# Altium project obc_ver2.PrjPcb (part 2 of 3)

## Sheet obc-v2_EXP-CAN-RS422.SchDoc
size 420 x 297 mm; SheetNumber: 14; SheetTotal: 23
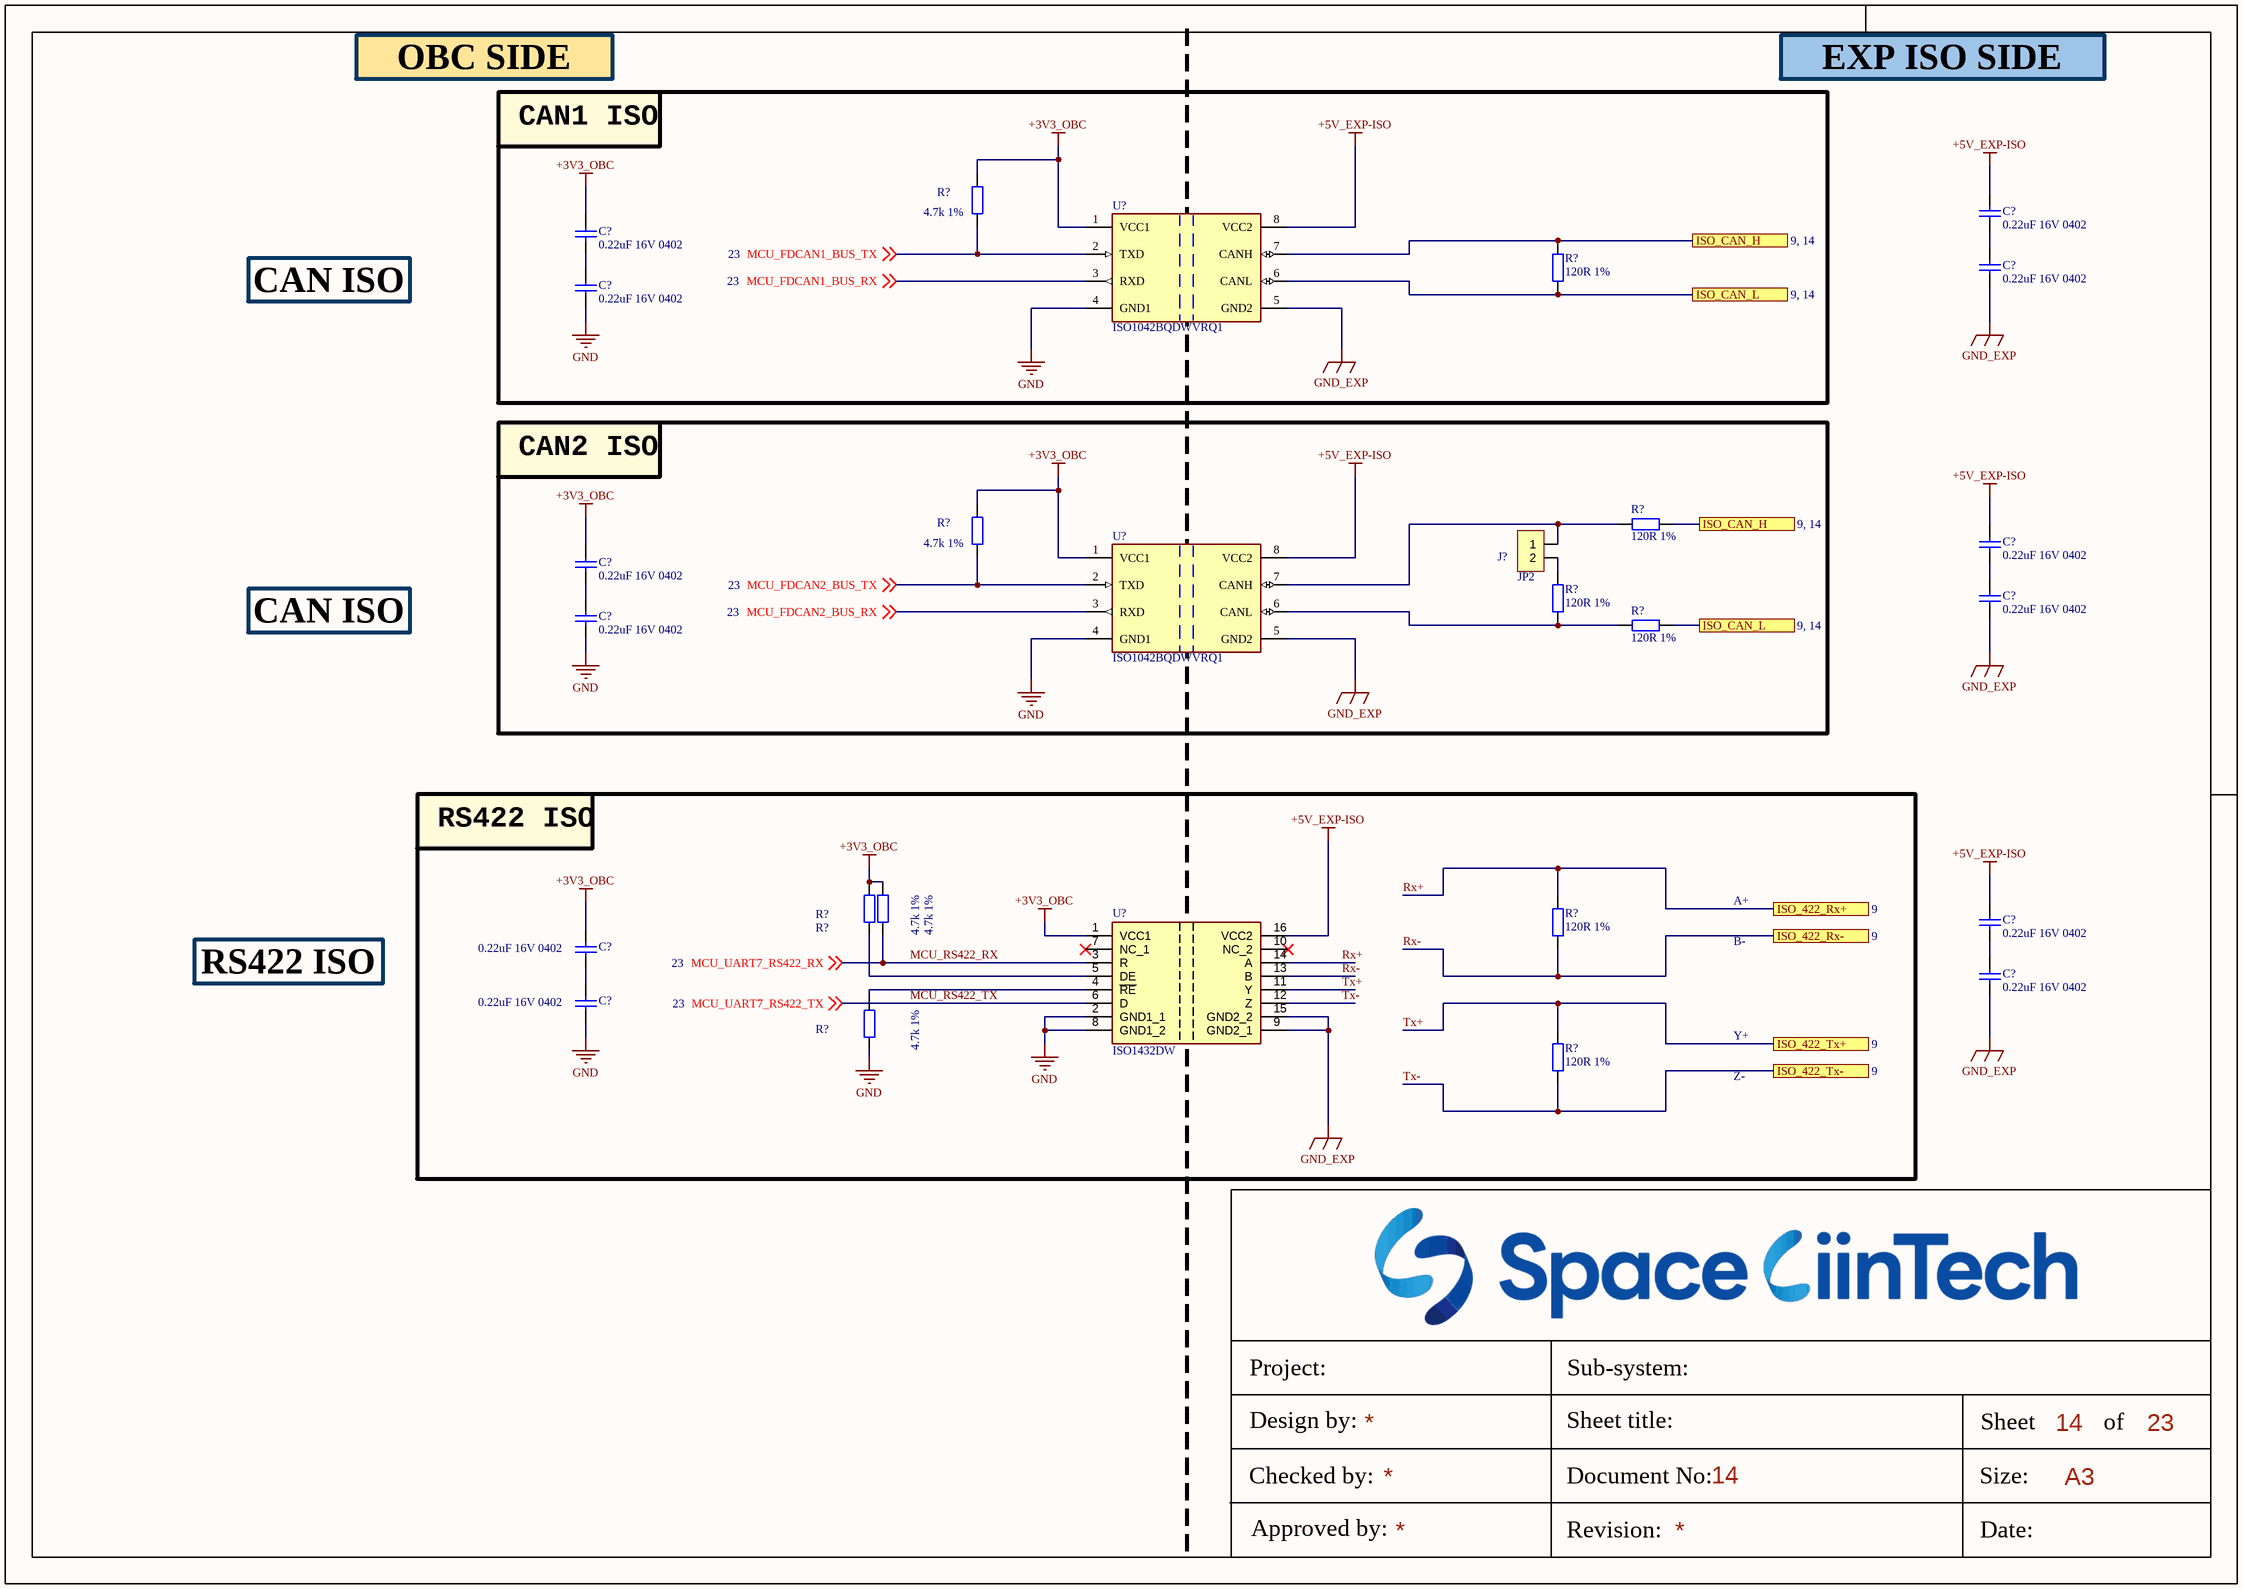
[diagram p13: obc-v2_EXP-CAN-RS422.SchDoc]

### Parts
(Parts that share a designator on the sheet are numbered #1, #2 ... from top to bottom, then left to right.)
C?#104  0.22uF 16V 0402  [tu 0402]
C?#105  0.22uF 16V 0402  [tu 0402]
C?#106  0.22uF 16V 0402  [tu 0402]
C?#107  0.22uF 16V 0402  [tu 0402]
C?#108  0.22uF 16V 0402  [tu 0402]
C?#109  0.22uF 16V 0402  [tu 0402]
C?#110  0.22uF 16V 0402  [tu 0402]
C?#111  0.22uF 16V 0402  [tu 0402]
C?#112  0.22uF 16V 0402  [tu 0402]
C?#113  0.22uF 16V 0402  [tu 0402]
C?#114  0.22uF 16V 0402  [tu 0402]
C?#115  0.22uF 16V 0402  [tu 0402]
J?#15  JP2  [JP2-D1T]
R?#47  4.7k 1%  [tro smd 0603]
R?#48  120R 1%  [tro smd 0603]
R?#49  120R 1%  [tro smd 0603]
R?#50  4.7k 1%  [tro smd 0603]
R?#51  120R 1%  [tro smd 0603]
R?#52  120R 1%  [tro smd 0603]
R?#53  4.7k 1%  [tro smd 0603]
R?#54  4.7k 1%  [tro smd 0603]
R?#55  120R 1%  [tro smd 0603]
R?#56  4.7k 1%  [tro smd 0603]
R?#57  120R 1%  [tro smd 0603]
U?#18  ISO1042BQDWVRQ1  [FP-DWV0008A-IPC_B]
U?#19  ISO1042BQDWVRQ1  [FP-DWV0008A-IPC_B]
U?#20  ISO1432DW  [SOIC127P1030X265-16N]

### Blocks framed on the sheet
CAN1 ISO: C?#105 C?#107 R?#47 R?#48 U?#18
CAN2 ISO: C?#109 C?#111 J?#15 R?#49-R?#52 U?#19
RS422 ISO: C?#113 C?#115 R?#53-R?#57 U?#20

### Ports
ISO_422_Rx+ (see 9), ISO_422_Rx- (see 9), ISO_422_Tx+ (see 9), ISO_422_Tx- (see 9), ISO_CAN_H (see 9, 14), ISO_CAN_L (see 9, 14)

### Nets
+3V3_OBC: C?#105.1 C?#109.1 C?#113.1 R?#47.2 R?#50.2 R?#53.2 R?#54.2 U?#18.1(VCC1) U?#19.1(VCC1) U?#20.1(VCC1)
+5V_EXP-ISO: C?#104.1 C?#108.1 C?#112.2 U?#18.8(VCC2) U?#19.8(VCC2) U?#20.16(VCC2)
GND: C?#107.2 C?#111.2 C?#115.2 R?#56.1 U?#18.4(GND1) U?#19.4(GND1) U?#20.2(GND1_1) U?#20.8(GND1_2)
GND_EXP: C?#106.2 C?#110.2 C?#114.1 U?#18.5(GND2) U?#19.5(GND2) U?#20.9(GND2_1) U?#20.15(GND2_2)
MCU_FDCAN1_BUS_RX: U?#18.3(RXD) ; off-sheet MCU_FDCAN1_BUS_RX
MCU_FDCAN1_BUS_TX: R?#47.1 U?#18.2(TXD) ; off-sheet MCU_FDCAN1_BUS_TX
MCU_FDCAN2_BUS_RX: U?#19.3(RXD) ; off-sheet MCU_FDCAN2_BUS_RX
MCU_FDCAN2_BUS_TX: R?#50.1 U?#19.2(TXD) ; off-sheet MCU_FDCAN2_BUS_TX
MCU_RS422_RX: R?#54.1 U?#20.3(R) ; off-sheet MCU_UART7_RS422_RX  [also labelled MCU_UART7_RS422_RX]
MCU_RS422_TX: U?#20.6(D) ; off-sheet MCU_UART7_RS422_TX  [also labelled MCU_UART7_RS422_TX]
Rx+: R?#55.2 U?#20.14(A) ; port ISO_422_Rx+
Rx-: R?#55.1 U?#20.13(B) ; port ISO_422_Rx-
Tx+: R?#57.2 U?#20.11(Y) ; port ISO_422_Tx+
Tx-: R?#57.1 U?#20.12(Z) ; port ISO_422_Tx-
NetC?#104_2: C?#104.2 C?#106.1
NetC?#105_2: C?#105.2 C?#107.1
NetC?#108_2: C?#108.2 C?#110.1
NetC?#109_2: C?#109.2 C?#111.1
NetC?#112_1: C?#112.1 C?#114.2
NetC?#113_2: C?#113.2 C?#115.1
NetJ?#3_4: R?#48.2 R?#49.1 U?#18.7(CANH) ; port ISO_CAN_H
NetJ?#3_25: R?#48.1 R?#52.1 U?#18.6(CANL) ; port ISO_CAN_L
NetJ?#15_1: J?#15.1 R?#49.2 U?#19.7(CANH)
NetJ?#15_2: J?#15.2 R?#51.2
NetR?#51_1: R?#51.1 R?#52.2 U?#19.6(CANL)
NetR?#53_1: R?#53.1 U?#20.5(DE)
NetR?#56_2: R?#56.2 U?#20.4(~{RE})

Not connected (* = marked no-connect by the designer): U?#20 7(NC_1)* 10(NC_2)*

### Notes on the sheet
- OBC SIDE
- EXP ISO SIDE
- CAN ISO
- A+
- RS422 ISO
- B-
- Y+
- Z-
- Project:
- Sub-system:
- Design by:
- Sheet title:
- Sheet
- A3
- of
- Checked by:
- Approved by:
- Revision:
- Document No:
- Size:
- Date:

### Library data of the parts
C?#104-C?#115 = Tu 0402 33nF 10V: as C?#1 on sheet obc-v2_POWER; Kieu_Chan: *
J?#15 = JP2: as J?#6 on sheet obc-v2_DEBUG; Created Date: 29 March 2013; ComponentLink1URL: http://www.we-online.com; ComponentLink2URL: http://katalog.we-online.de/em/datasheet/6130xx143121.pdf; Created by: Karrer Zheng
R?#47 R?#50 R?#53 R?#54 R?#56 = Tro 0603 1% 10k: as R?#2 on sheet obc-v2_OUT-eMMC; Kieu_Chan: *
R?#48 R?#49 R?#51 R?#52 R?#55 R?#57 = Tro 0603 1% 10k: RES SMD 120 OHM 1% 1/4W 0603, P/N: RCS0603120RFKEA; Chung_Loai: Dán; Don_Vi: Con; So_Chan: 2; Ten_Linh_Kien: Trở 0603 1% 10k; Ma_Hang: MH006333; Kieu_Chan: *
U?#18 U?#19 = CMP-04872-000086-1: TRANSCEIVER; RoHS Compliant: Yes
U?#20 = ISO1432DWR: RS-422/RS-485 Interface IC 5-kVrms isolated RS-485/RS-422 transceiver with robust EMC 16-SOIC -40 to 125; Manufacturer_Name: Texas Instruments; Manufacturer_Part_Number: ISO1430DW; Geometry.Height: 2.65mm; Mouser Part Number: 595-ISO1430DW; Mouser Price/Stock: https://www.mouser.co.uk/ProductDetail/Texas-Instruments/ISO1430DW?qs=EBDBlbfErPzpJh5zkcdiFg%3D%3D; Arrow Part Number: ISO1430DW; Arrow Price/Stock: https://www.arrow.com/en/products/iso1430dw/texas-instruments?region=nac; Datasheet Link: https://datasheet.datasheetarchive.com/originals/distributors/Datasheets_SAMA/30467ff99f72399b87c3bb1b8b60cbd8.pdf

## Sheet obc-v2_CM4-M2.SchDoc
size 420 x 297 mm; SheetNumber: 15; SheetTotal: 23
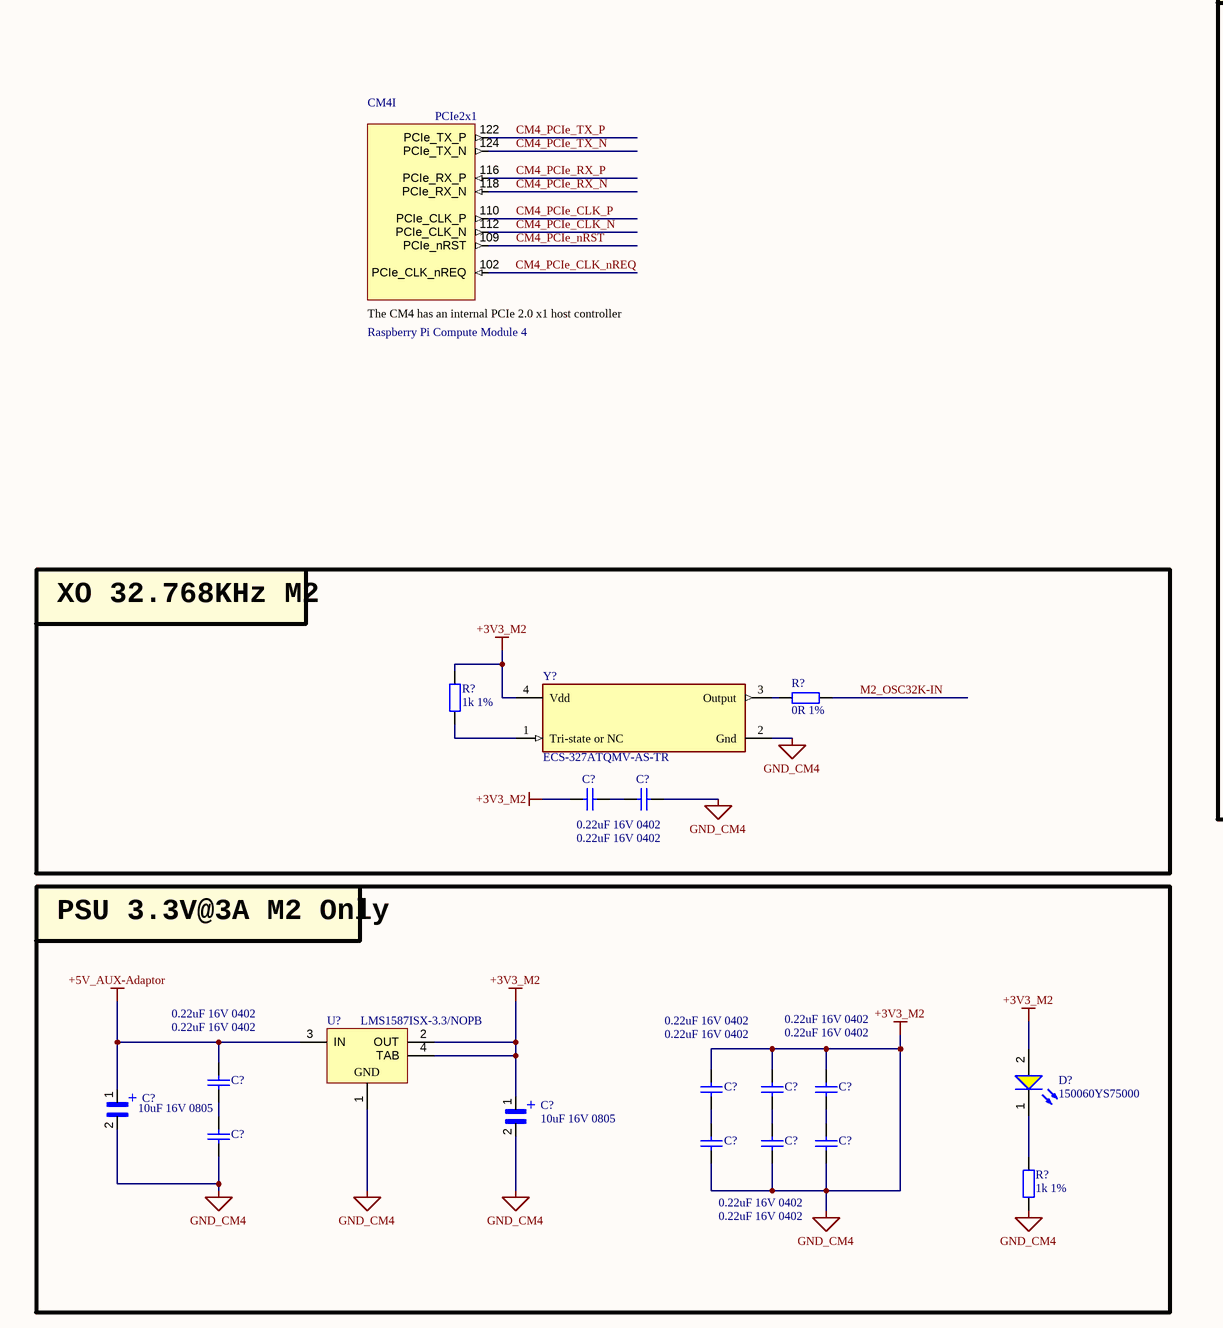
[diagram p14: obc-v2_CM4-M2.SchDoc, left]
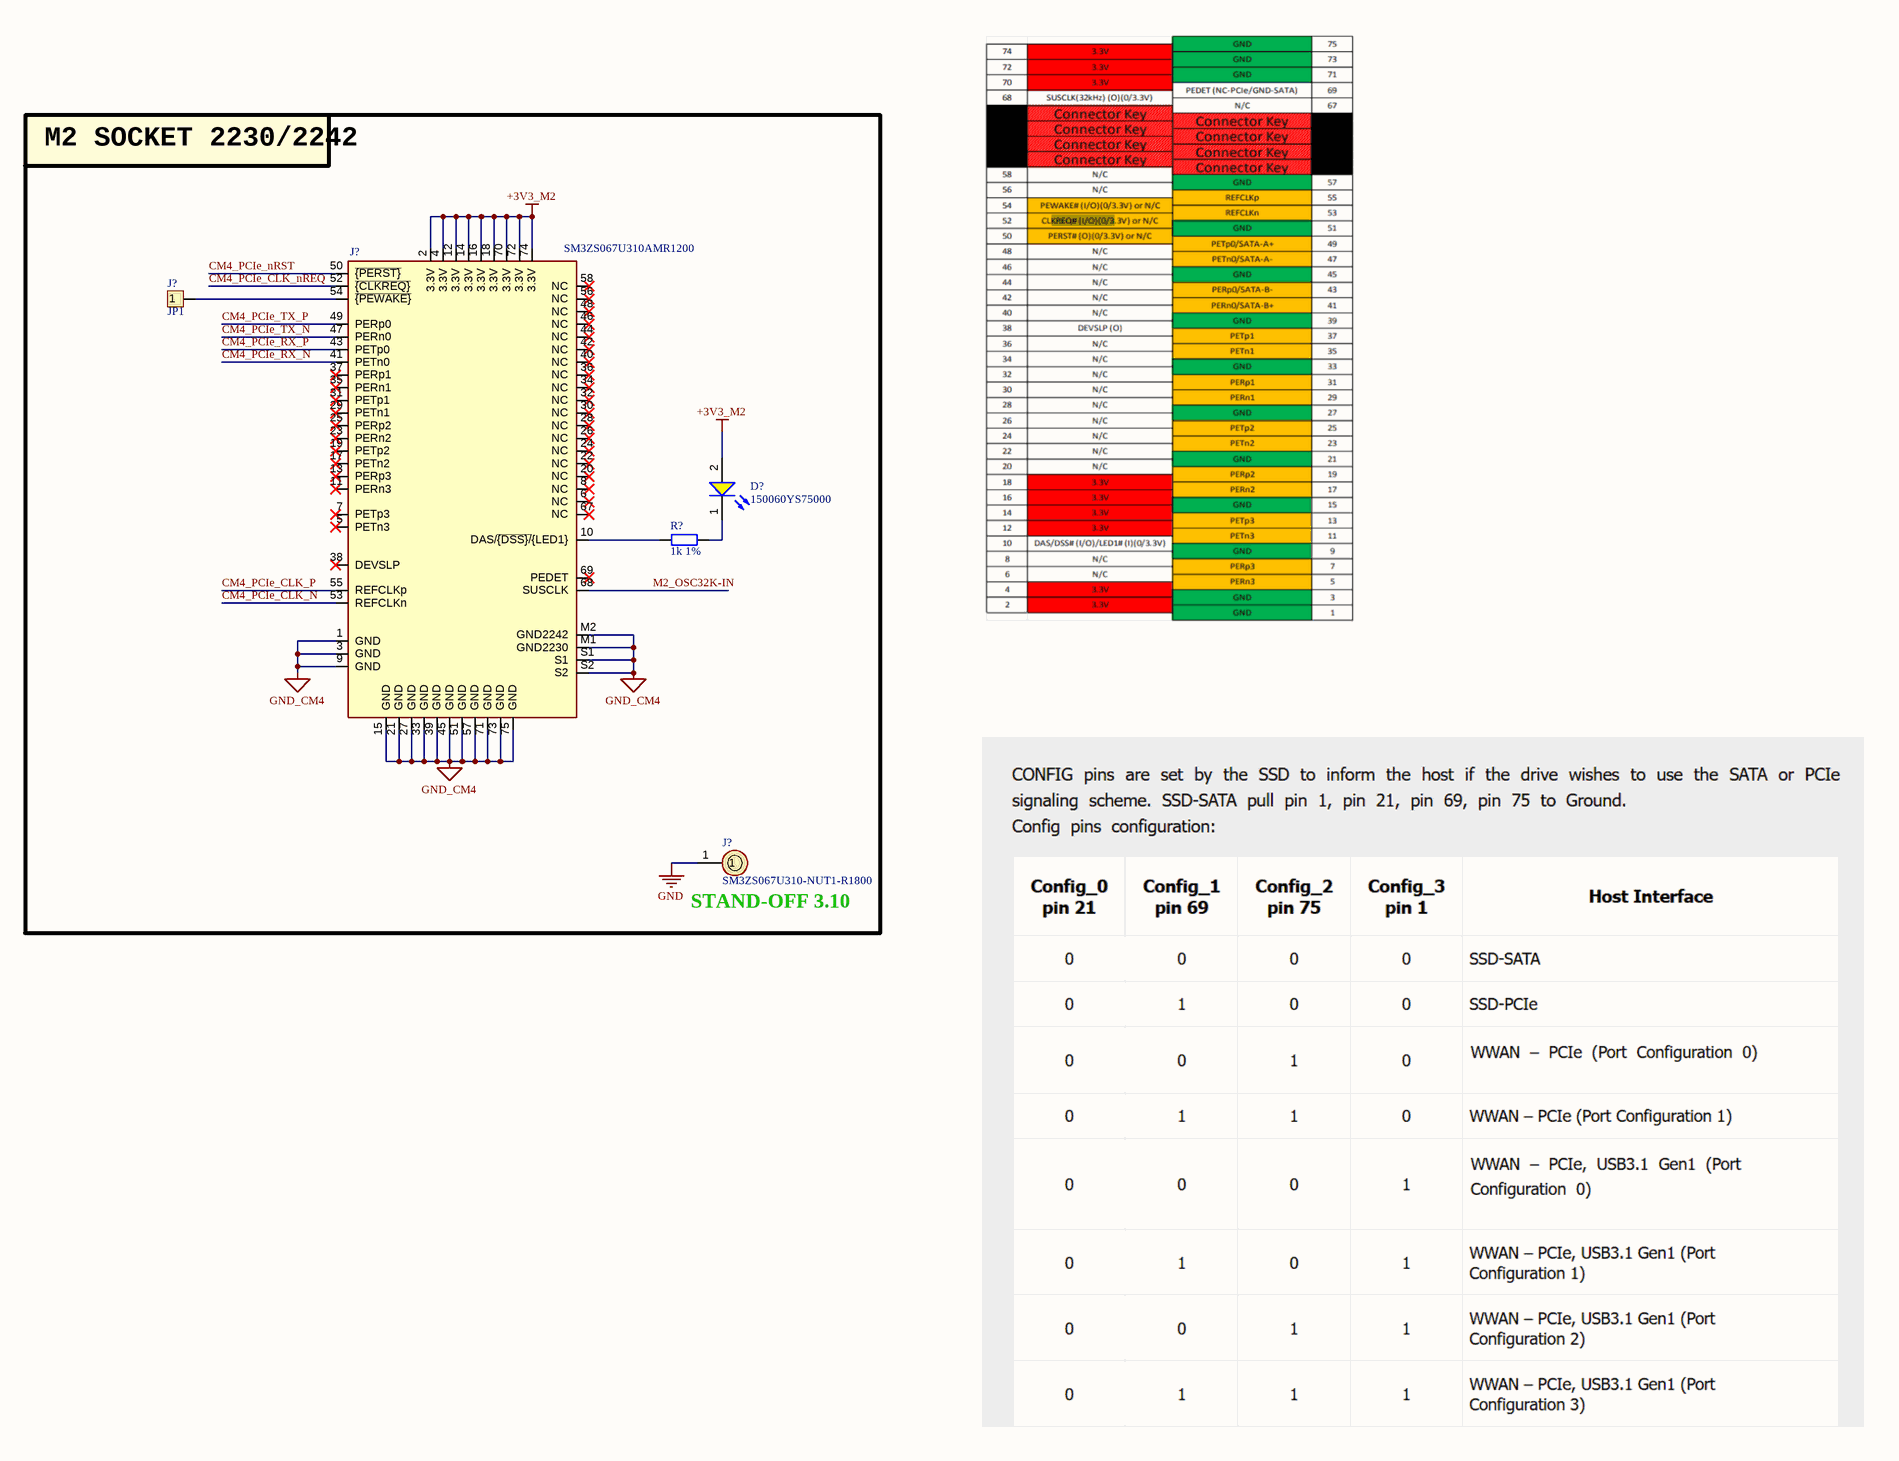
[diagram p15: obc-v2_CM4-M2.SchDoc, right]

### Parts
(Parts that share a designator on the sheet are numbered #1, #2 ... from top to bottom, then left to right.)
C?#116  0.22uF 16V 0402  [tu 0402]
C?#117  0.22uF 16V 0402  [tu 0402]
C?#118  0.22uF 16V 0402  [tu 0402]
C?#119  0.22uF 16V 0402  [tu 0402]
C?#120  0.22uF 16V 0402  [tu 0402]
C?#121  0.22uF 16V 0402  [tu 0402]
C?#122  10uF 16V 0805  [CAPC2012X140N]
C?#123  10uF 16V 0805  [CAPC2012X140N]
C?#124  0.22uF 16V 0402  [tu 0402]
C?#125  0.22uF 16V 0402  [tu 0402]
C?#126  0.22uF 16V 0402  [tu 0402]
C?#127  0.22uF 16V 0402  [tu 0402]
CM4  Raspberry Pi Compute Module 4  [CM4-DF40HC(3.0)-100DS-0.4v_3mm_1.5mm]  (part I of 21)  (no BOM)
D?#10  150060YS75000  [WL-SMCW_0603_150060xx75000]
D?#11  150060YS75000  [WL-SMCW_0603_150060xx75000]
J?#16  JP1  [JP1-D1T]
J?#17  value SM3ZS067U310AMR1200  [M.2 M Key socket]  (hidden comment: Bus_M.2_Socket_M)
J?#18  SM3ZS067U310-NUT1-R1800  [SM3ZS067U310NUT1R1800]
R?#58  1k 1%  [tro smd 0603]
R?#59  1k 1%  [tro smd 0603]
R?#60  0R 1%  [tro smd 0603]
R?#61  1k 1%  [tro smd 0603]
U?#21  LMS1587ISX-3.3/NOPB  [TS3B_L]
Y?#2  ECS-327ATQMV-AS-TR  [FP-327ATQMV-MFG]

### Blocks framed on the sheet
M2 SOCKET 2230/2242: D?#10 J?#16-J?#18 R?#58
XO 32.768KHz M2: C?#116 C?#117 R?#59 R?#60 Y?#2
PSU 3.3V@3A M2 Only: C?#118-C?#127 D?#11 R?#61 U?#21

### Nets
+3V3_M2: C?#116.1 C?#117.2 C?#119.1 C?#120.1 C?#121.1 C?#122.2 C?#123.1 C?#123.2 C?#124.2 C?#125.2 C?#126.2 C?#127.2 D?#10.2(A) D?#11.2(A) J?#17.1(GND) J?#17.2(3.3V) J?#17.3(GND) J?#17.4(3.3V) J?#17.9(GND) J?#17.12(3.3V) J?#17.14(3.3V) J?#17.15(GND) J?#17.16(3.3V) J?#17.18(3.3V) J?#17.21(GND) J?#17.27(GND) J?#17.33(GND) J?#17.39(GND) J?#17.45(GND) J?#17.51(GND) J?#17.57(GND) J?#17.70(3.3V) J?#17.71(GND) J?#17.72(3.3V) J?#17.73(GND) J?#17.74(3.3V) J?#17.75(GND) J?#17.M1(GND2230) J?#17.M2(GND2242) J?#17.S1 J?#17.S2 R?#59.1 R?#61.2 U?#21.1(GND) U?#21.2(OUT) U?#21.4(TAB) Y?#2.2(Gnd) Y?#2.4(Vdd)  [also labelled GND_CM4]
+5V_AUX-Adaptor: C?#118.1 C?#122.1 U?#21.3(IN)
GND: J?#18.1
CM4_PCIe_CLK_N: CM4.112(PCIe_CLK_N) J?#17.53(REFCLKn)
CM4_PCIe_CLK_nREQ: CM4.102(PCIe_CLK_nREQ) J?#17.52(~{{CLKREQ}})
CM4_PCIe_CLK_P: CM4.110(PCIe_CLK_P) J?#17.55(REFCLKp)
CM4_PCIe_nRST: CM4.109(PCIe_nRST) J?#17.50(~{{PERST}})
CM4_PCIe_RX_N: CM4.118(PCIe_RX_N) J?#17.41(PETn0)
CM4_PCIe_RX_P: CM4.116(PCIe_RX_P) J?#17.43(PETp0)
CM4_PCIe_TX_N: CM4.124(PCIe_TX_N) J?#17.47(PERn0)
CM4_PCIe_TX_P: CM4.122(PCIe_TX_P) J?#17.49(PERp0)
M2_OSC32K-IN: J?#17.68(SUSCLK) R?#60.1
NetC?#116_2: C?#116.2 C?#117.1
NetC?#118_2: C?#118.2 C?#124.1
NetC?#119_2: C?#119.2 C?#125.1
NetC?#120_2: C?#120.2 C?#126.1
NetC?#121_2: C?#121.2 C?#127.1
NetD?#10_1: D?#10.1(K) R?#58.1
NetD?#11_1: D?#11.1(K) R?#61.1
NetJ?#16_1: J?#16.1 J?#17.54(~{{PEWAKE}})
NetJ?#17_10: J?#17.10(DAS/~{{DSS}/}{LED1}) R?#58.2
NetR?#59_2: R?#59.2 Y?#2.1(Tri-state_or_NC)
NetR?#60_2: R?#60.2 Y?#2.3(Output)

Not connected (* = marked no-connect by the designer): J?#17 5(PETn3)* 6(NC)* 7(PETp3)* 8(NC)* 11(PERn3)* 13(PERp3)* 17(PETn2)* 19(PETp2)* 20(NC)* 22(NC)* 23(PERn2)* 24(NC)* 25(PERp2)* 26(NC)* 28(NC)* 29(PETn1)* 30(NC)* 31(PETp1)* 32(NC)* 34(NC)* 35(PERn1)* 36(NC)* 37(PERp1)* 38(DEVSLP)* 40(NC)* 42(NC)* 44(NC)* 46(NC)* 48(NC)* 56(NC)* 58(NC)* 67(NC)* 69(PEDET)*

### Notes on the sheet
- (near J?#18) STAND-OFF 3.10
- Project:
- Sub-system:
- Design by:
- Sheet title:
- Sheet
- A3
- of
- Checked by:
- Approved by:
- Revision:
- Document No:
- Size:
- Date:
- (in symbol CM4, part I) PCIe2x1; The CM4 has an internal PCIe 2.0 x1 host controller
- (in symbol TACR686M003RTA) +

### Library data of the parts
C?#116-C?#121 C?#124-C?#127 = Tu 0402 33nF 10V: as C?#1 on sheet obc-v2_POWER; Kieu_Chan: *
C?#122 C?#123 = TACR686M003RTA: as C?#2 on sheet obc-v2_POWER; Availability: Unavailable; SnapEDA_Link: https://www.snapeda.com/parts/TACR686M003RTA/AVX/view-part/1745975/?ref=snap; MP: TACR686M003RTA; Value: *; Price: None; Package: 0805 AVX
CM4 = CM4: Raspberry Pi Compute Module 4 by Amornthep Phunsin
D?#10 D?#11 = CMP-1426-00005-2: as D?#1 on sheet obc-v2_POWER; Case Code (Imperial): 0603; Height: 700µm; REACH SVHC: Unknown; Dominant Wavelength: 590nm; Min Operating Temperature: -40°C; Color: Yellow; Width: 800µm; Mount: Surface Mount; Packaging: Tape and Reel; Max Operating Temperature: 85°C; RoHS: Compliant; Max Reverse Voltage (DC): 5V; Case Code (Metric): 1608; Length: 1.6mm; Case/Package: 0603
J?#16 = JP1: WR-PHD 2.54 mm Angled Socket Header; Manufacturer: W¨¹rth Elektronik eiSos GmbH; partNo: 613002143121; ComponentLink1 Description: Manufacturer; ComponentLink2 Description: Datasheet; NoPins: 02; Created Date: 29 March 2013; ComponentLink1URL: http://www.we-online.com; ComponentLink2URL: http://katalog.we-online.de/em/datasheet/6130xx143121.pdf; Created by: Karrer Zheng
J?#17 = Bus_M.2_Socket_M: Part Description: M.2 M Key connector; Field5: MTSSD03-67MSW337; Field7: MTCONN; Field6: MTSSD03-67MSW337; Footprint: CM5IO:M.2 M Key socket
J?#18 = SM3ZS067U310-NUT1-R1800: On-board mounting type, PCI-SIG M.2 Specification compatible, Compatible Connector: SM3ZS067U310*, nut; Manufacturer_Name: JAE; Geometry.Height: 2.16mm; Mouser Part Number: 656-SM3ZS67U31NT1800; Mouser Price/Stock: https://www.mouser.co.uk/ProductDetail/JAE-Electronics/SM3ZS067U310-NUT1-R1800?qs=KdTYp8tcPglw%252BOu69xOHRA%3D%3D; Manufacturer_Part_Number: SM3ZS067U310-NUT1-R1800; Datasheet Link: https://www.jae.com/direct/topics/topics_file_download/topics_id=68932&ext_no=06&_lang=en&v=
R?#58 R?#61 = Tro 0603 1% 10k: as R?#1 on sheet obc-v2_POWER; Kieu_Chan: *
R?#59 R?#60 = Tro 0603 1% 10k: as R?#2 on sheet obc-v2_OUT-eMMC; Kieu_Chan: *
U?#21 = CMP-0062-00180-3: 3A Low Dropout Fast Response Regulators, 3-pin TO-263, Pb-Free; Manufacturer: National Semiconductor; PowerWise: N; High-Reliability: Y; PackageTopMarking: NSUZXYTTE#*LMS1587*IS-3.3; CompType: LDO IC; ComponentLink1Description: Manufacturer URL; PackageReference: TS3B; ComponentLink1URL: http://www.national.com/; ComponentLink2URL: http://www.national.com/ds/LM/LMS1587.pdf; DatasheetVersion: Jun-2005; ComponentLink3URL: http://www.national.com/pf/LM/LMS1587.html; PartNumber: LMS1587ISX-3.3/NOPB; RevisionNote: SCH symbol layout adjusted; PinCount: 3; RoHS: Y; Code_JEDEC: MO-169-AA; PackageDescription: TO-263, Molded, .400 x .390 x .180in, 3 Lead, .1in Pitch, Surface Mount; ComponentLink4Description: TS3B Package Page; ComponentLink3Description: LMS1587 Web Page; PackageVersion: revF, Apr-2005; ComponentLink2Description: LMS1587 Datasheet; ComponentLink4URL: http://www.national.com/packaging/folders/ts3b.html
Y?#2 = CMP-40224-000027-1: XTAL OSC XO 32.7680KHZ CMOS SMD; RoHS Compliant: Yes

## Sheet obc-v2_CM4-PinOut.SchDoc
size 420 x 297 mm; SheetNumber: 16; SheetTotal: 23
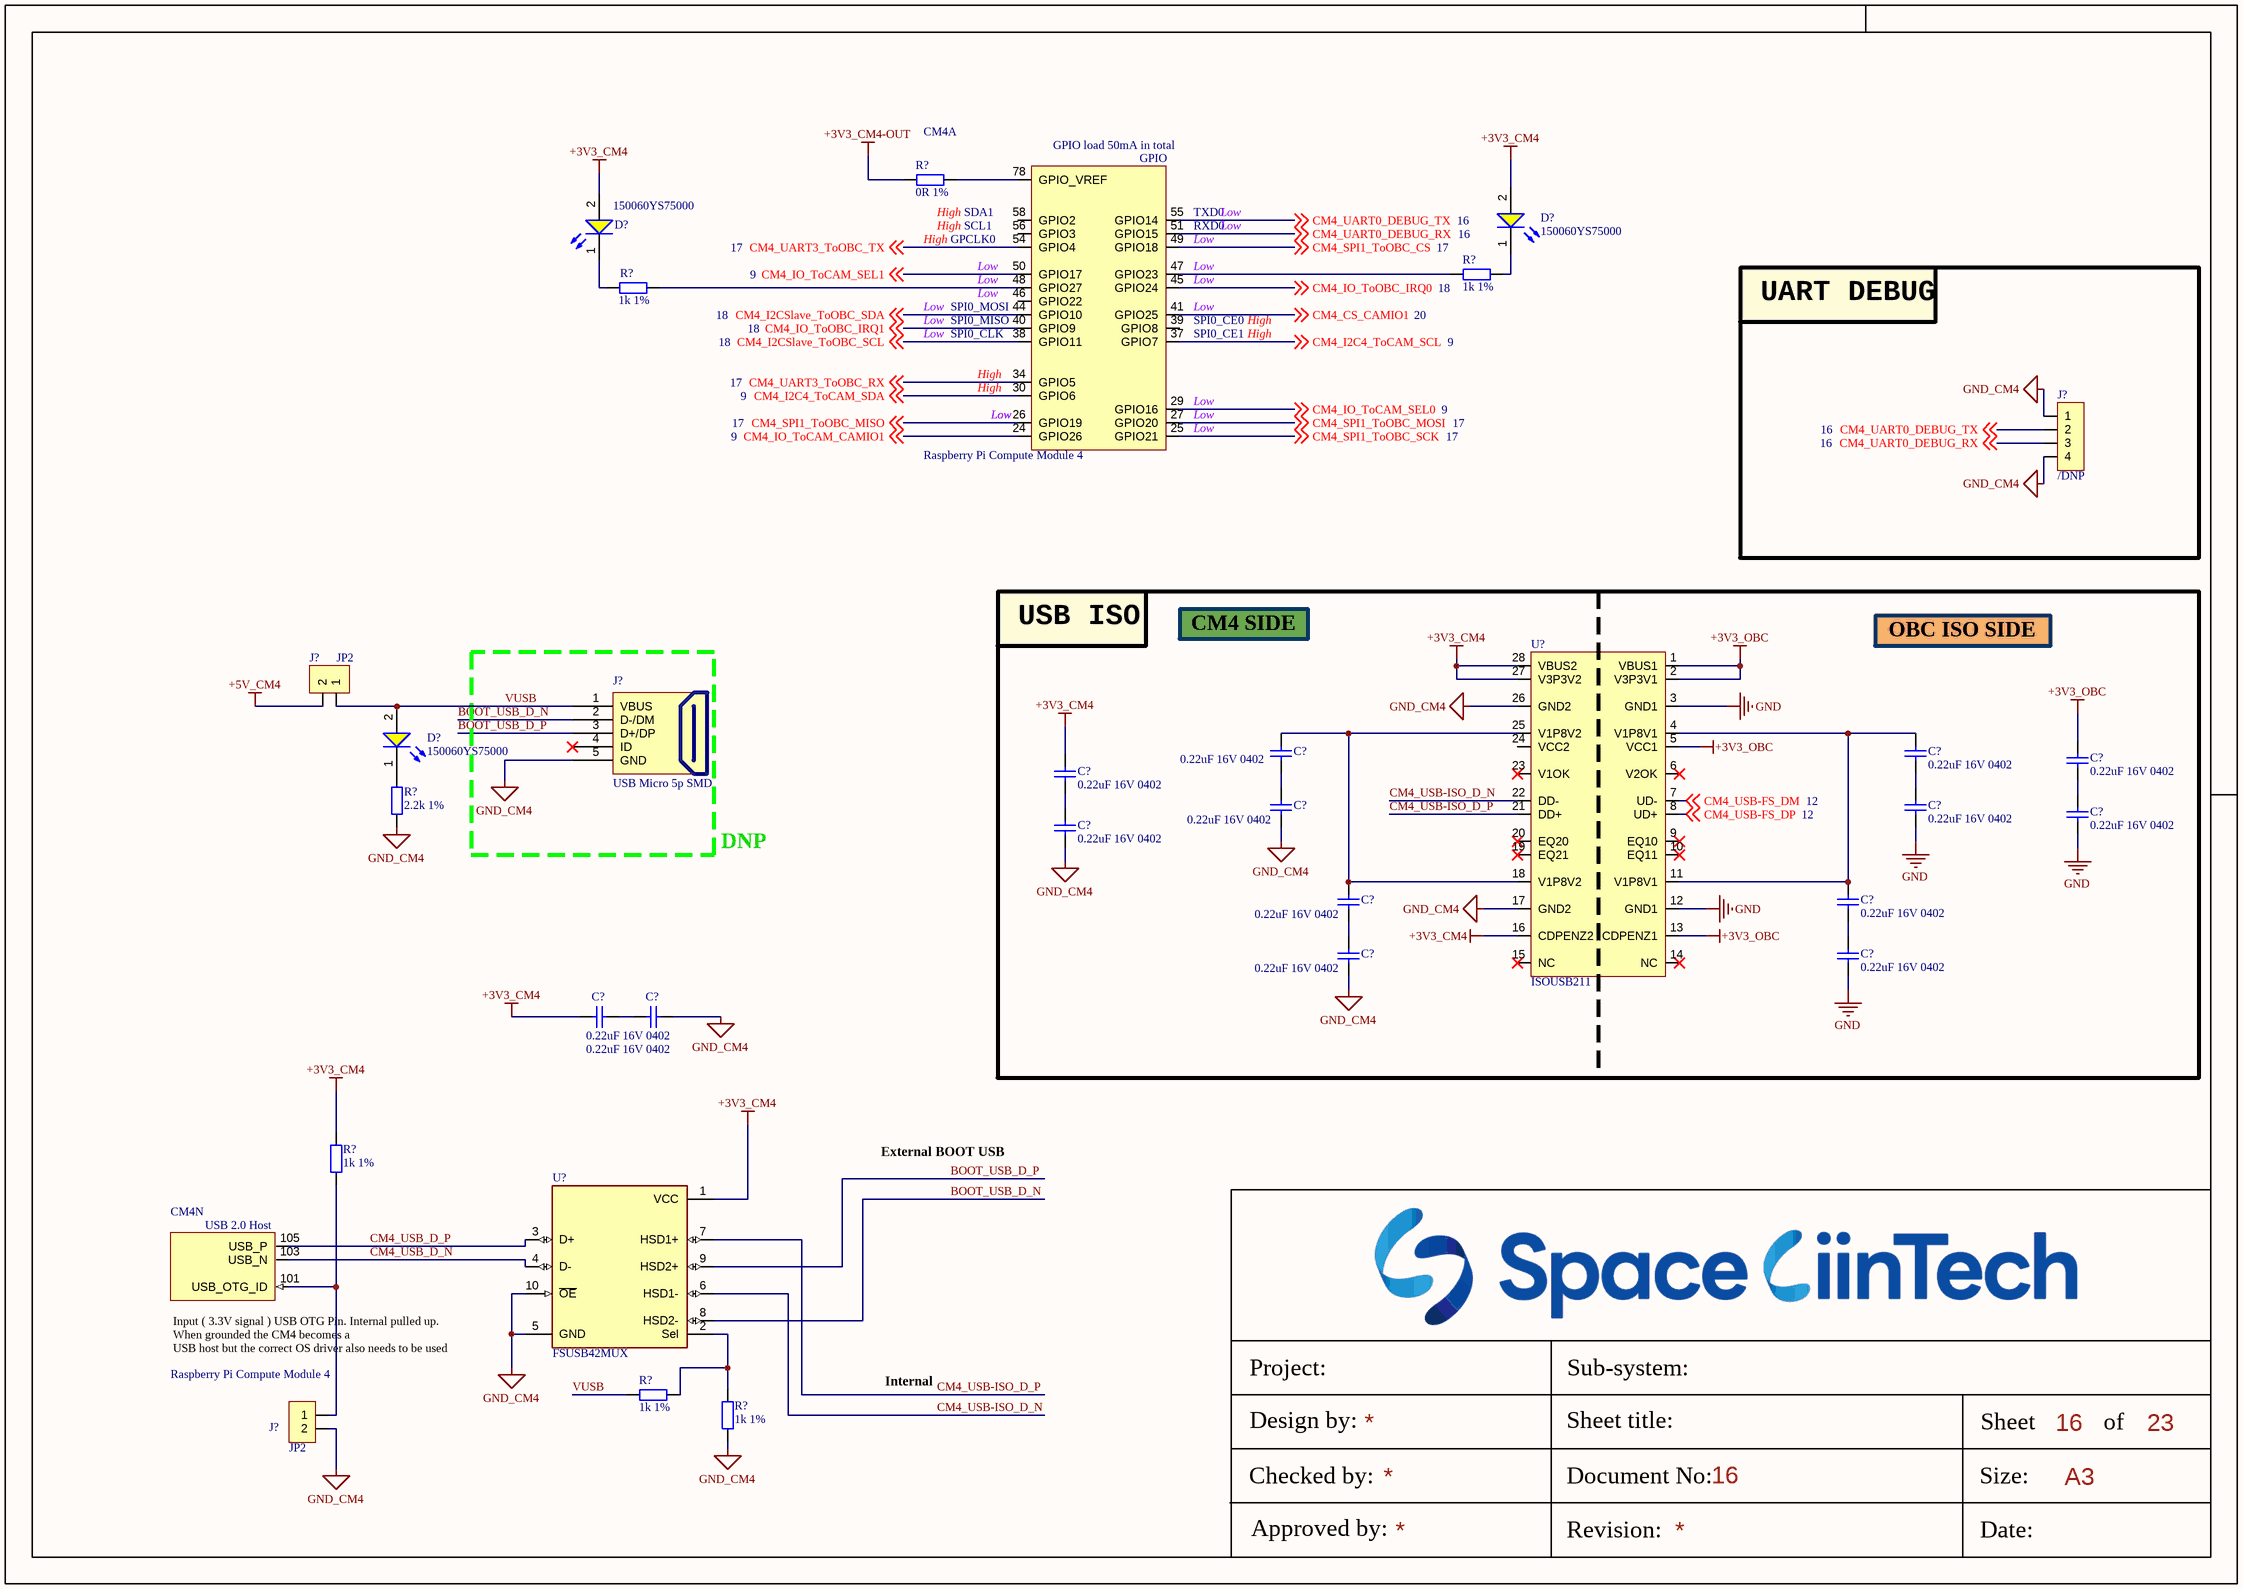
[diagram p16: obc-v2_CM4-PinOut.SchDoc]

### Parts
(Parts that share a designator on the sheet are numbered #1, #2 ... from top to bottom, then left to right.)
C?#128  0.22uF 16V 0402  [tu 0402]
C?#129  0.22uF 16V 0402  [tu 0402]
C?#130  0.22uF 16V 0402  [tu 0402]
C?#131  0.22uF 16V 0402  [tu 0402]
C?#132  0.22uF 16V 0402  [tu 0402]
C?#133  0.22uF 16V 0402  [tu 0402]
C?#134  0.22uF 16V 0402  [tu 0402]
C?#135  0.22uF 16V 0402  [tu 0402]
C?#136  0.22uF 16V 0402  [tu 0402]
C?#137  0.22uF 16V 0402  [tu 0402]
C?#138  0.22uF 16V 0402  [tu 0402]
C?#139  0.22uF 16V 0402  [tu 0402]
C?#140  0.22uF 16V 0402  [tu 0402]
C?#141  0.22uF 16V 0402  [tu 0402]
CM4  Raspberry Pi Compute Module 4  [CM4-DF40HC(3.0)-100DS-0.4v_3mm_1.5mm]  (parts A,N of 21)  (no BOM)
D?#12  150060YS75000  [WL-SMCW_0603_150060xx75000]
D?#13  150060YS75000  [WL-SMCW_0603_150060xx75000]
D?#14  150060YS75000  [WL-SMCW_0603_150060xx75000]
J?#19  /DNP  [JP4-C1T]
J?#20  JP2  [JP2-D1T]
J?#21  USB Micro 5p SMD  [USB Micro 5p SMD]
J?#22  JP2  [JP2-D1T]
R?#62  0R 1%  [tro smd 0603]
R?#63  1k 1%  [tro smd 0603]
R?#64  1k 1%  [tro smd 0603]
R?#65  2.2k 1%  [tro smd 0603]
R?#66  1k 1%  [tro smd 0603]
R?#67  1k 1%  [tro smd 0603]
R?#68  1k 1%  [tro smd 0603]
U?#22  ISOUSB211
U?#23  FSUSB42MUX  [FP-846AP-MFG]

### Blocks framed on the sheet
UART DEBUG: J?#19
USB ISO: C?#128-C?#139 U?#22

### Nets
+3V3_CM4: C?#131.1 C?#140.1 D?#12.2(A) D?#13.2(A) R?#66.1 U?#22.16(CDPENZ2) U?#22.27(V3P3V2) U?#22.28(VBUS2) U?#23.1(VCC)
+3V3_CM4-OUT: R?#62.1
+3V3_OBC: C?#130.1 U?#22.1(VBUS1) U?#22.2(V3P3V1) U?#22.5(VCC1) U?#22.13(CDPENZ1)
+5V_CM4: J?#20.2  [project net +5V_AUX-Adaptor]
GND: C?#133.2 C?#134.2 C?#139.2 U?#22.3(GND1) U?#22.12(GND1)
GND_CM4: C?#132.2 C?#135.2 C?#138.2 C?#141.2 J?#19.1 J?#19.4 J?#21.5(GND) J?#22.2 R?#65.2 R?#68.2 U?#22.17(GND2) U?#22.26(GND2) U?#23.5(GND) U?#23.10(~{OE})  [project net +3V3_M2]
BOOT_USB_D_N: J?#21.2(D-/DM) U?#23.8(HSD2-)
BOOT_USB_D_P: J?#21.3(D+/DP) U?#23.9(HSD2+)
CM4_CS_CAMIO1: CM4.41(GPIO25) ; off-sheet CM4_CS_CAMIO1
CM4_I2C4_ToCAM_SCL: CM4.37(GPIO7) ; off-sheet CM4_I2C4_ToCAM_SCL
CM4_I2C4_ToCAM_SDA: CM4.30(GPIO6) ; off-sheet CM4_I2C4_ToCAM_SDA
CM4_I2CSlave_ToOBC_SCL: CM4.38(GPIO11) ; off-sheet CM4_I2CSlave_ToOBC_SCL
CM4_I2CSlave_ToOBC_SDA: CM4.44(GPIO10) ; off-sheet CM4_I2CSlave_ToOBC_SDA
CM4_IO_ToCAM_CAMIO1: CM4.24(GPIO26) ; off-sheet CM4_IO_ToCAM_CAMIO1
CM4_IO_ToCAM_SEL0: CM4.29(GPIO16) ; off-sheet CM4_IO_ToCAM_SEL0
CM4_IO_ToCAM_SEL1: CM4.50(GPIO17) ; off-sheet CM4_IO_ToCAM_SEL1
CM4_IO_ToOBC_IRQ0: CM4.45(GPIO24) ; off-sheet CM4_IO_ToOBC_IRQ0
CM4_IO_ToOBC_IRQ1: CM4.40(GPIO9) ; off-sheet CM4_IO_ToOBC_IRQ1
CM4_SPI1_ToOBC_CS: CM4.49(GPIO18) ; off-sheet CM4_SPI1_ToOBC_CS  [project net CM4_SPI1_ISO_CS]
CM4_SPI1_ToOBC_MISO: CM4.26(GPIO19) ; off-sheet CM4_SPI1_ToOBC_MISO  [project net CM4_SPI1_ISO_MISO]
CM4_SPI1_ToOBC_MOSI: CM4.27(GPIO20) ; off-sheet CM4_SPI1_ToOBC_MOSI  [project net CM4_SPI1_ISO_MOSI]
CM4_SPI1_ToOBC_SCK: CM4.25(GPIO21) ; off-sheet CM4_SPI1_ToOBC_SCK  [project net CM4_SPI1_ISO_SCK]
CM4_UART0_DEBUG_RX: CM4.51(GPIO15) J?#19.3 ; off-sheet CM4_UART0_DEBUG_RX
CM4_UART0_DEBUG_TX: CM4.55(GPIO14) J?#19.2 ; off-sheet CM4_UART0_DEBUG_TX
CM4_UART3_ToOBC_RX: CM4.34(GPIO5) ; off-sheet CM4_UART3_ToOBC_RX
CM4_UART3_ToOBC_TX: CM4.54(GPIO4) ; off-sheet CM4_UART3_ToOBC_TX
CM4_USB-FS_DM: U?#22.7(UD-) ; off-sheet CM4_USB-FS_DM  [project net CM4_USB-FS_HUB_D_N]
CM4_USB-FS_DP: U?#22.8(UD+) ; off-sheet CM4_USB-FS_DP  [project net CM4_USB-FS_HUB_D_P]
CM4_USB-ISO_D_N: U?#22.22(DD-) U?#23.6(HSD1-)
CM4_USB-ISO_D_P: U?#22.21(DD+) U?#23.7(HSD1+)
CM4_USB_D_N: CM4.103(USB_N) U?#23.4(D-)
CM4_USB_D_P: CM4.105(USB_P) U?#23.3(D+)
VUSB: D?#14.2(A) J?#20.1 J?#21.1(VBUS) R?#67.1
NetC?#128_1: C?#128.1 C?#136.1 U?#22.18(V1P8V2) U?#22.25(V1P8V2)
NetC?#128_2: C?#128.2 C?#132.1
NetC?#129_1: C?#129.1 C?#137.1 U?#22.4(V1P8V1) U?#22.11(V1P8V1)
NetC?#129_2: C?#129.2 C?#133.1
NetC?#130_2: C?#130.2 C?#134.1
NetC?#131_2: C?#131.2 C?#135.1
NetC?#136_2: C?#136.2 C?#138.1
NetC?#137_2: C?#137.2 C?#139.1
NetC?#140_2: C?#140.2 C?#141.1
NetCM4_47: CM4.47(GPIO23) R?#63.2
NetCM4_48: CM4.48(GPIO27) R?#64.2
NetCM4_78: CM4.78(GPIO_VREF) R?#62.2
NetCM4_101: CM4.101(USB_OTG_ID) J?#22.1 R?#66.2
NetD?#12_1: D?#12.1(K) R?#63.1
NetD?#13_1: D?#13.1(K) R?#64.1
NetD?#14_1: D?#14.1(K) R?#65.1
NetR?#67_2: R?#67.2 R?#68.1 U?#23.2(Sel)

Not connected (* = marked no-connect by the designer): CM4 39(GPIO8) 46(GPIO22) 56(GPIO3) 58(GPIO2); J?#21 4(ID)*; U?#22 6(V2OK)* 9(EQ10)* 10(EQ11)* 14(NC)* 15(NC)* 19(EQ21)* 20(EQ20)* 23(V1OK)* 24(VCC2)

### Notes on the sheet
- CM4 SIDE
- OBC ISO SIDE
- DNP
- External BOOT USB
- Internal
- Project:
- Sub-system:
- Design by:
- Sheet title:
- Sheet
- A3
- of
- Checked by:
- Approved by:
- Revision:
- Document No:
- Size:
- Date:
- (in symbol CM4, part A) GPIO load 50mA in total; GPIO; High; SDA1; TXD0; Low; SCL1; RXD0; GPCLK0; SPI0_MOSI; SPI0_MISO; SPI0_CE0; SPI0_CLK; SPI0_CE1; by Amornthep Phunsin
- (in symbol CM4, part N) USB 2.0 Host; Input ( 3.3V signal ) USB OTG Pin. Internal pulled up. When grounded the CM4 becomes a / USB host but the correct OS driver also needs to be used

### Library data of the parts
C?#128-C?#141 = Tu 0402 33nF 10V: 0.22 µF ±10% 16V Ceramic Capacitor X7R 0402 (1005 Metric): GCM155R71C224KE02D; Chung_Loai: Dán; Don_Vi: Con; So_Chan: 2; Ten_Linh_Kien: Tụ 0402 33nF X7R 10V GRM155R71A333KA01D; Ma_Hang: MH007853; Kieu_Chan: *
CM4 = CM4: Raspberry Pi Compute Module 4 by Amornthep Phunsin
D?#12-D?#14 = CMP-1426-00005-2: LED YELLOW CLEAR 0603 SMD; NexarPartId: 29687085; Wavelength: 590nm; Luminous Intensity: 120mcd; Peak Wavelength: 595nm; Forward Current: 100mA; Power Dissipation: 72mW; Forward Voltage: 2V; Test Current: 20mA; Reverse Voltage: 5V; Lens Style: Clear, Rectangular; Max Junction Temperature (Tj): 95°C; Viewing Angle: 140°; Case Code (Imperial): 0603; Height: 700µm; REACH SVHC: Unknown; Dominant Wavelength: 590nm; Min Operating Temperature: -40°C; Color: Yellow; Width: 800µm; Mount: Surface Mount; Packaging: Tape and Reel; Max Operating Temperature: 85°C; RoHS: Compliant; Max Reverse Voltage (DC): 5V; Case Code (Metric): 1608; Length: 1.6mm; Case/Package: 0603
J?#19 = JP4: WR-PHD 2.54 mm Angled Socket Header; Manufacturer: W¨¹rth Elektronik eiSos GmbH; partNo: 613004143121; ComponentLink1 Description: Manufacturer; ComponentLink2 Description: Datasheet; NoPins: 04; Created Date: 29 March 2013; ComponentLink1URL: http://www.we-online.com; ComponentLink2URL: http://katalog.we-online.de/em/datasheet/6130xx143121.pdf; Created by: Karrer Zheng
J?#20 J?#22 = JP2: WR-PHD 2.54 mm Angled Socket Header; Manufacturer: W¨¹rth Elektronik eiSos GmbH; partNo: 613002143121; ComponentLink1 Description: Manufacturer; ComponentLink2 Description: Datasheet; NoPins: 02; Created Date: 29 March 2013; ComponentLink1URL: http://www.we-online.com; ComponentLink2URL: http://katalog.we-online.de/em/datasheet/6130xx143121.pdf; Created by: Karrer Zheng
J?#21 = USB Micro 5p SMD: USB Type B; Ten: MicroUSB MK5P SMD; Ma_Hang: MH001020
R?#62 = Tro 0603 1% 10k: RES 4.7K OHM 1% 1/10W 0603, P/N: ERJ-U03F4701V; Chung_Loai: Dán; Don_Vi: Con; So_Chan: 2; Ten_Linh_Kien: Trở 0603 1% 10k; Ma_Hang: MH006333; Kieu_Chan: *
R?#63-R?#68 = Tro 0603 1% 10k: RES SMD 2.2K OHM 1% 1/10W 0603, P/N: ERJ-3EKF2201V; Chung_Loai: Dán; Don_Vi: Con; So_Chan: 2; Ten_Linh_Kien: Trở 0603 1% 10k; Ma_Hang: MH006333; Kieu_Chan: *
U?#23 = CMP-07103-000004-1: IC USB SWITCH DPDT 10MSOP; Voltage: 4.3V; Current: 100mA; Number of Inputs: 2; Supply Type: Single; Number of Outputs: 4; Data Rate: 480Mbps; On-State Resistance: 6.5R; Min Supply Voltage: 3V; Package Quantity: 1; Length: 3mm; Radiation Hardening: No; Number of Pins: 10; Width: 3mm; Number of Channels: 2; REACH SVHC: No SVHC; Lead Free: Lead Free; Max Operating Temperature: 85°C; Min Operating Temperature: -40°C; Packaging: Tape and Reel; Throw Configuration: DPDT; Operating Supply Voltage: 4.3V; Max Supply Voltage: 4.3V; Mount: Surface Mount; Case/Package: MSOP; Weight: 0.1125g; Height: 0.85mm

## Sheet obc-v2_CM4-SPI-UART.SchDoc
size 420 x 297 mm; SheetNumber: 17; SheetTotal: 23
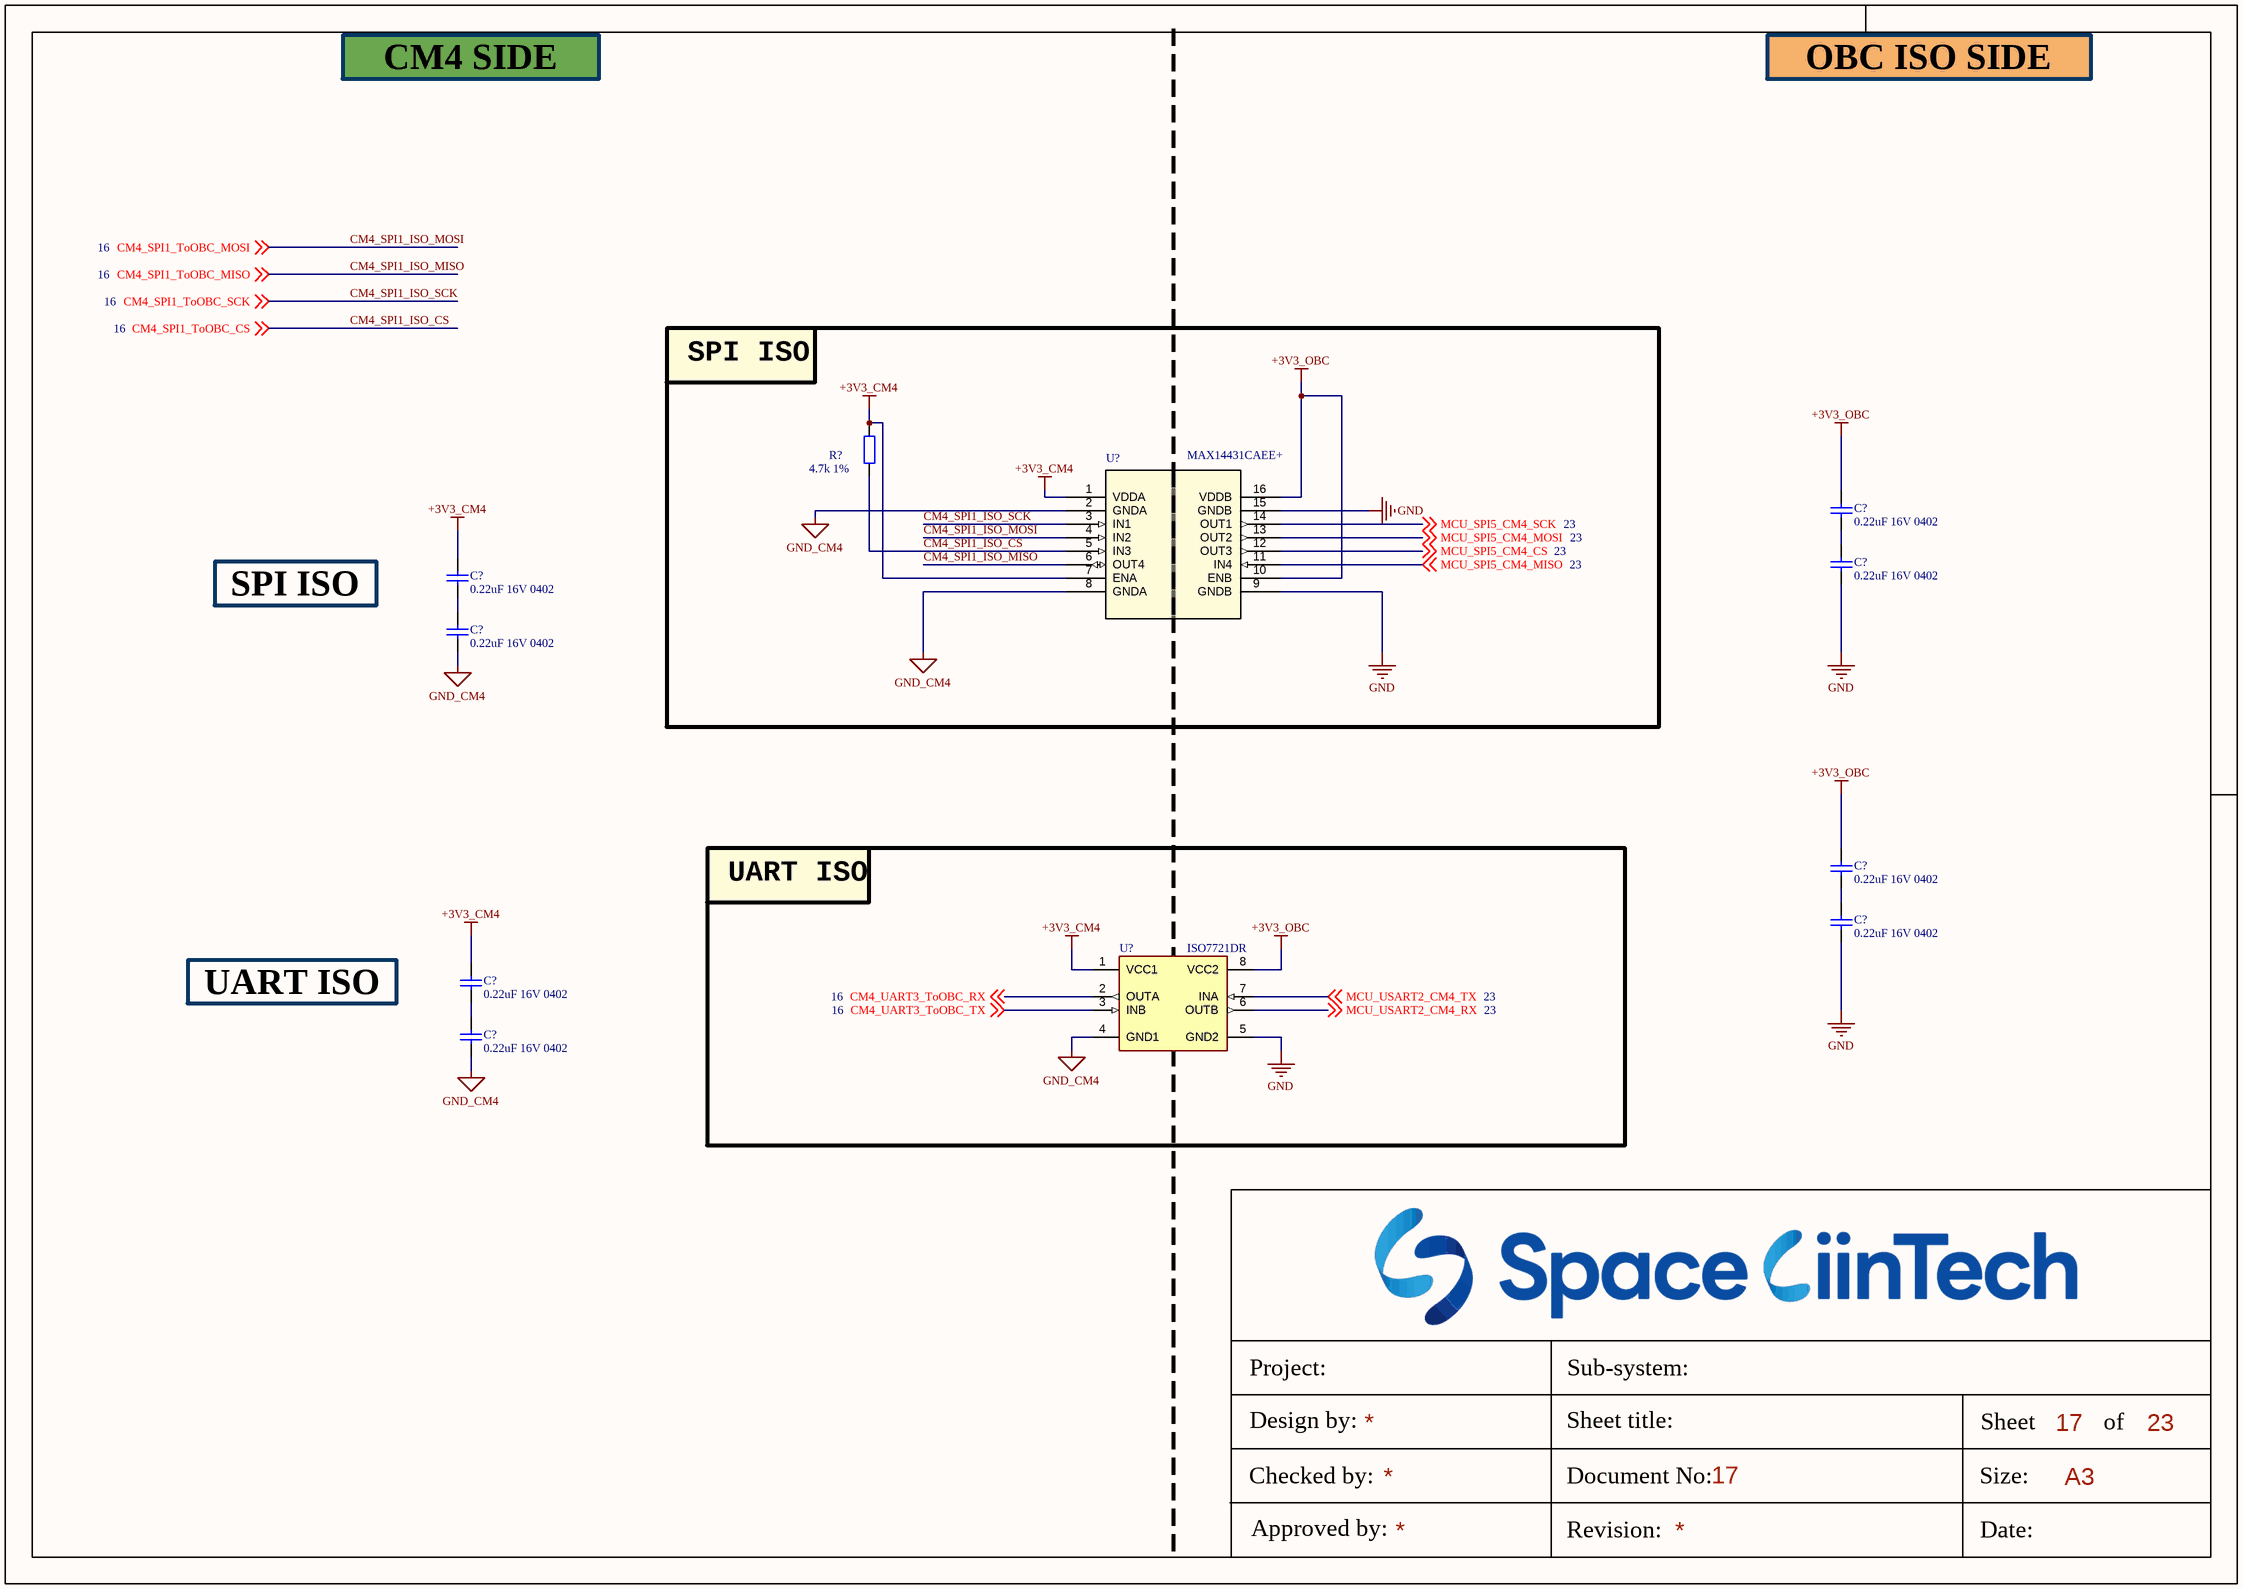
[diagram p17: obc-v2_CM4-SPI-UART.SchDoc]

### Parts
(Parts that share a designator on the sheet are numbered #1, #2 ... from top to bottom, then left to right.)
C?#142  0.22uF 16V 0402  [tu 0402]
C?#143  0.22uF 16V 0402  [tu 0402]
C?#144  0.22uF 16V 0402  [tu 0402]
C?#145  0.22uF 16V 0402  [tu 0402]
C?#146  0.22uF 16V 0402  [tu 0402]
C?#147  0.22uF 16V 0402  [tu 0402]
C?#148  0.22uF 16V 0402  [tu 0402]
C?#149  0.22uF 16V 0402  [tu 0402]
R?#69  4.7k 1%  [tro smd 0603]
U?#24  MAX14431CAEE+  [21-0055Q_E16MS+1F_MXM]
U?#25  ISO7721DR  [SOIC127P599X175-8N]

### Blocks framed on the sheet
SPI ISO: R?#69 U?#24
UART ISO: U?#25

### Nets
+3V3_CM4: C?#144.1 C?#148.1 R?#69.2 U?#24.1(VDDA) U?#24.7(ENA) U?#25.1(VCC1)
+3V3_OBC: C?#142.2 C?#146.2 U?#24.10(ENB) U?#24.16(VDDB) U?#25.8(VCC2)
GND: C?#143.1 C?#147.1 U?#24.9(GNDB) U?#24.15(GNDB) U?#25.5(GND2)
GND_CM4: C?#145.2 C?#149.2 U?#24.2(GNDA) U?#24.8(GNDA) U?#25.4(GND1)  [project net +3V3_M2]
CM4_SPI1_ISO_CS: R?#69.1 U?#24.5(IN3) ; off-sheet CM4_SPI1_ToOBC_CS  [also labelled CM4_SPI1_ToOBC_CS]
CM4_SPI1_ISO_MISO: U?#24.6(OUT4) ; off-sheet CM4_SPI1_ToOBC_MISO  [also labelled CM4_SPI1_ToOBC_MISO]
CM4_SPI1_ISO_MOSI: U?#24.4(IN2) ; off-sheet CM4_SPI1_ToOBC_MOSI  [also labelled CM4_SPI1_ToOBC_MOSI]
CM4_SPI1_ISO_SCK: U?#24.3(IN1) ; off-sheet CM4_SPI1_ToOBC_SCK  [also labelled CM4_SPI1_ToOBC_SCK]
CM4_UART3_ToOBC_RX: U?#25.2(OUTA) ; off-sheet CM4_UART3_ToOBC_RX
CM4_UART3_ToOBC_TX: U?#25.3(INB) ; off-sheet CM4_UART3_ToOBC_TX
MCU_SPI5_CM4_CS: U?#24.12(OUT3) ; off-sheet MCU_SPI5_CM4_CS
MCU_SPI5_CM4_MISO: U?#24.11(IN4) ; off-sheet MCU_SPI5_CM4_MISO
MCU_SPI5_CM4_MOSI: U?#24.13(OUT2) ; off-sheet MCU_SPI5_CM4_MOSI
MCU_SPI5_CM4_SCK: U?#24.14(OUT1) ; off-sheet MCU_SPI5_CM4_SCK
MCU_USART2_CM4_RX: U?#25.6(OUTB) ; off-sheet MCU_USART2_CM4_RX
MCU_USART2_CM4_TX: U?#25.7(INA) ; off-sheet MCU_USART2_CM4_TX
NetC?#142_1: C?#142.1 C?#143.2
NetC?#144_2: C?#144.2 C?#145.1
NetC?#146_1: C?#146.1 C?#147.2
NetC?#148_2: C?#148.2 C?#149.1

### Notes on the sheet
- CM4 SIDE
- OBC ISO SIDE
- SPI ISO
- UART ISO
- Project:
- Sub-system:
- Design by:
- Sheet title:
- Sheet
- A3
- of
- Checked by:
- Approved by:
- Revision:
- Document No:
- Size:
- Date:

### Library data of the parts
C?#142-C?#149 = Tu 0402 33nF 10V: as C?#128-C?#141 on sheet obc-v2_CM4-PinOut; Kieu_Chan: *
R?#69 = Tro 0603 1% 10k: as R?#62 on sheet obc-v2_CM4-PinOut; Kieu_Chan: *
U?#24 = MAX14431CAEE+: No Description Available; Mfr_Name: Analog Devices / Maxim Integrated; RefDes: RefDes; Type: Type
U?#25 = ISO7721DR: Robust EMC, dual-channel, 1/1, reinforced digital isolator 8-SOIC -55 to 125; Package: None; Value: *; MP: ISO7721DR; Availability: Unavailable; Price: None

## Sheet obc-v2_CM4-IRQ-CTRL.SchDoc
size 420 x 297 mm; SheetNumber: 18; SheetTotal: 23
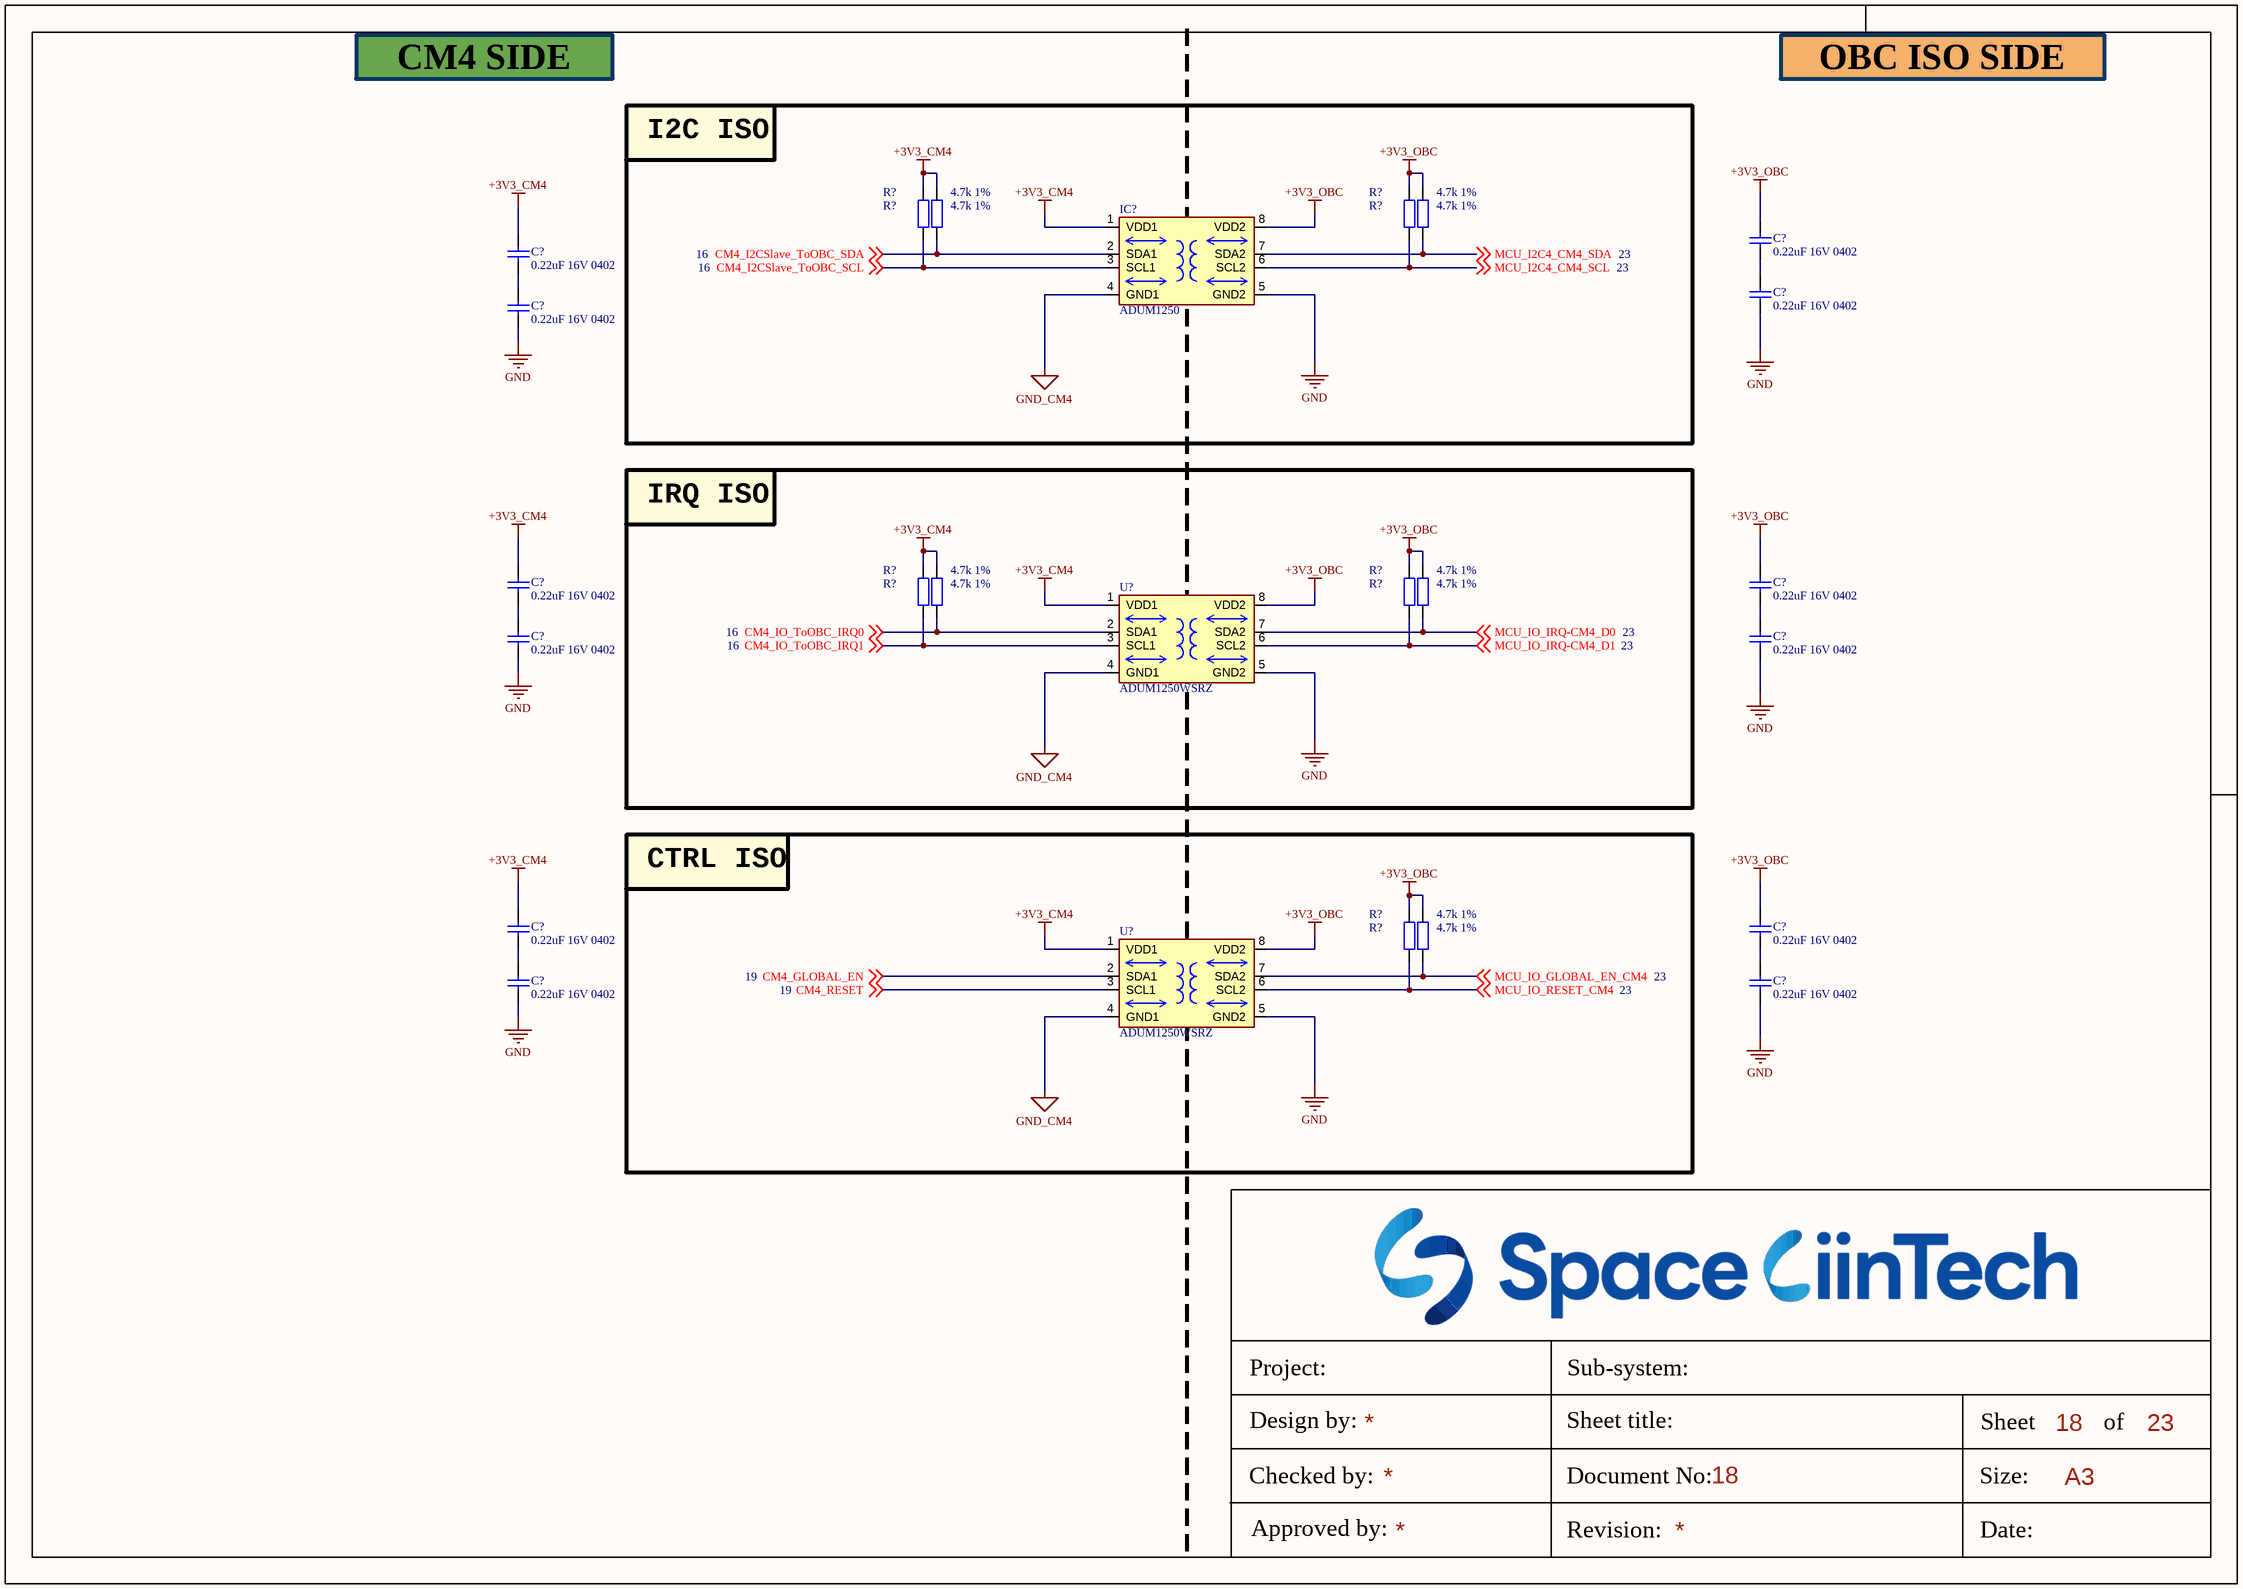
[diagram p18: obc-v2_CM4-IRQ-CTRL.SchDoc]

### Parts
(Parts that share a designator on the sheet are numbered #1, #2 ... from top to bottom, then left to right.)
C?#150  0.22uF 16V 0402  [tu 0402]
C?#151  0.22uF 16V 0402  [tu 0402]
C?#152  0.22uF 16V 0402  [tu 0402]
C?#153  0.22uF 16V 0402  [tu 0402]
C?#154  0.22uF 16V 0402  [tu 0402]
C?#155  0.22uF 16V 0402  [tu 0402]
C?#156  0.22uF 16V 0402  [tu 0402]
C?#157  0.22uF 16V 0402  [tu 0402]
C?#158  0.22uF 16V 0402  [tu 0402]
C?#159  0.22uF 16V 0402  [tu 0402]
C?#160  0.22uF 16V 0402  [tu 0402]
C?#161  0.22uF 16V 0402  [tu 0402]
IC?  ADUM1250  [SO8-COOL]
R?#70  4.7k 1%  [tro smd 0603]
R?#71  4.7k 1%  [tro smd 0603]
R?#72  4.7k 1%  [tro smd 0603]
R?#73  4.7k 1%  [tro smd 0603]
R?#74  4.7k 1%  [tro smd 0603]
R?#75  4.7k 1%  [tro smd 0603]
R?#76  4.7k 1%  [tro smd 0603]
R?#77  4.7k 1%  [tro smd 0603]
R?#78  4.7k 1%  [tro smd 0603]
R?#79  4.7k 1%  [tro smd 0603]
U?#26  ADUM1250WSRZ  [SO8-COOL]
U?#27  ADUM1250WSRZ  [SO8-COOL]

### Blocks framed on the sheet
I2C ISO: IC? R?#70-R?#73
IRQ ISO: R?#74-R?#77 U?#26
CTRL ISO: R?#78 R?#79 U?#27

### Nets
+3V3_CM4: C?#151.1 C?#154.1 C?#158.1 IC?.1(VDD1) R?#70.2 R?#71.2 R?#74.2 R?#75.2 U?#26.1(VDD1) U?#27.1(VDD1)
+3V3_OBC: C?#150.1 C?#155.1 C?#159.1 IC?.8(VDD2) R?#72.2 R?#73.2 R?#76.2 R?#77.2 R?#78.2 R?#79.2 U?#26.8(VDD2) U?#27.8(VDD2)
GND: C?#152.2 C?#153.2 C?#156.2 C?#157.2 C?#160.2 C?#161.2 IC?.5(GND2) U?#26.5(GND2) U?#27.5(GND2)
GND_CM4: IC?.4(GND1) U?#26.4(GND1) U?#27.4(GND1)  [project net +3V3_M2]
CM4_GLOBAL_EN: U?#27.2(SDA1) ; off-sheet CM4_GLOBAL_EN  [project net CM4_ENABLE]
CM4_I2CSlave_ToOBC_SCL: IC?.3(SCL1) R?#70.1 ; off-sheet CM4_I2CSlave_ToOBC_SCL
CM4_I2CSlave_ToOBC_SDA: IC?.2(SDA1) R?#71.1 ; off-sheet CM4_I2CSlave_ToOBC_SDA
CM4_IO_ToOBC_IRQ0: R?#75.1 U?#26.2(SDA1) ; off-sheet CM4_IO_ToOBC_IRQ0
CM4_IO_ToOBC_IRQ1: R?#74.1 U?#26.3(SCL1) ; off-sheet CM4_IO_ToOBC_IRQ1
CM4_RESET: U?#27.3(SCL1) ; off-sheet CM4_RESET
MCU_I2C4_CM4_SCL: IC?.6(SCL2) R?#72.1 ; off-sheet MCU_I2C4_CM4_SCL
MCU_I2C4_CM4_SDA: IC?.7(SDA2) R?#73.1 ; off-sheet MCU_I2C4_CM4_SDA
MCU_IO_GLOBAL_EN_CM4: R?#79.1 U?#27.7(SDA2) ; off-sheet MCU_IO_GLOBAL_EN_CM4
MCU_IO_IRQ-CM4_D0: R?#77.1 U?#26.7(SDA2) ; off-sheet MCU_IO_IRQ-CM4_D0
MCU_IO_IRQ-CM4_D1: R?#76.1 U?#26.6(SCL2) ; off-sheet MCU_IO_IRQ-CM4_D1
MCU_IO_RESET_CM4: R?#78.1 U?#27.6(SCL2) ; off-sheet MCU_IO_RESET_CM4
NetC?#150_2: C?#150.2 C?#152.1
NetC?#151_2: C?#151.2 C?#153.1
NetC?#154_2: C?#154.2 C?#156.1
NetC?#155_2: C?#155.2 C?#157.1
NetC?#158_2: C?#158.2 C?#160.1
NetC?#159_2: C?#159.2 C?#161.1

### Notes on the sheet
- CM4 SIDE
- OBC ISO SIDE
- Project:
- Sub-system:
- Design by:
- Sheet title:
- Sheet
- A3
- of
- Checked by:
- Approved by:
- Revision:
- Document No:
- Size:
- Date:

### Library data of the parts
C?#150-C?#161 = Tu 0402 33nF 10V: as C?#128-C?#141 on sheet obc-v2_CM4-PinOut; Kieu_Chan: *
IC? U?#26 U?#27 = ADUM1250: IÂ²C Digital Isolator 2500Vrms 2 Channel 1Mbps 25kV/Âµs CMTI 8-SOIC (0.154", 3.90mm Width); MF: Analog Devices; Package: SOIC-8; Price: None; Value: *; SnapEDA_Link: https://www.snapeda.com/parts/ADUM1250/Analog+Devices/view-part/?ref=snap; MP: ADUM1250; Availability: Unavailable; Check_prices: https://www.snapeda.com/parts/ADUM1250/Analog+Devices/view-part/?ref=eda
R?#70-R?#79 = Tro 0603 1% 10k: as R?#62 on sheet obc-v2_CM4-PinOut; Kieu_Chan: *

## Sheet obc-v2_CM4-FUNCTION.SchDoc
size 420 x 297 mm; SheetNumber: 19; SheetTotal: 23
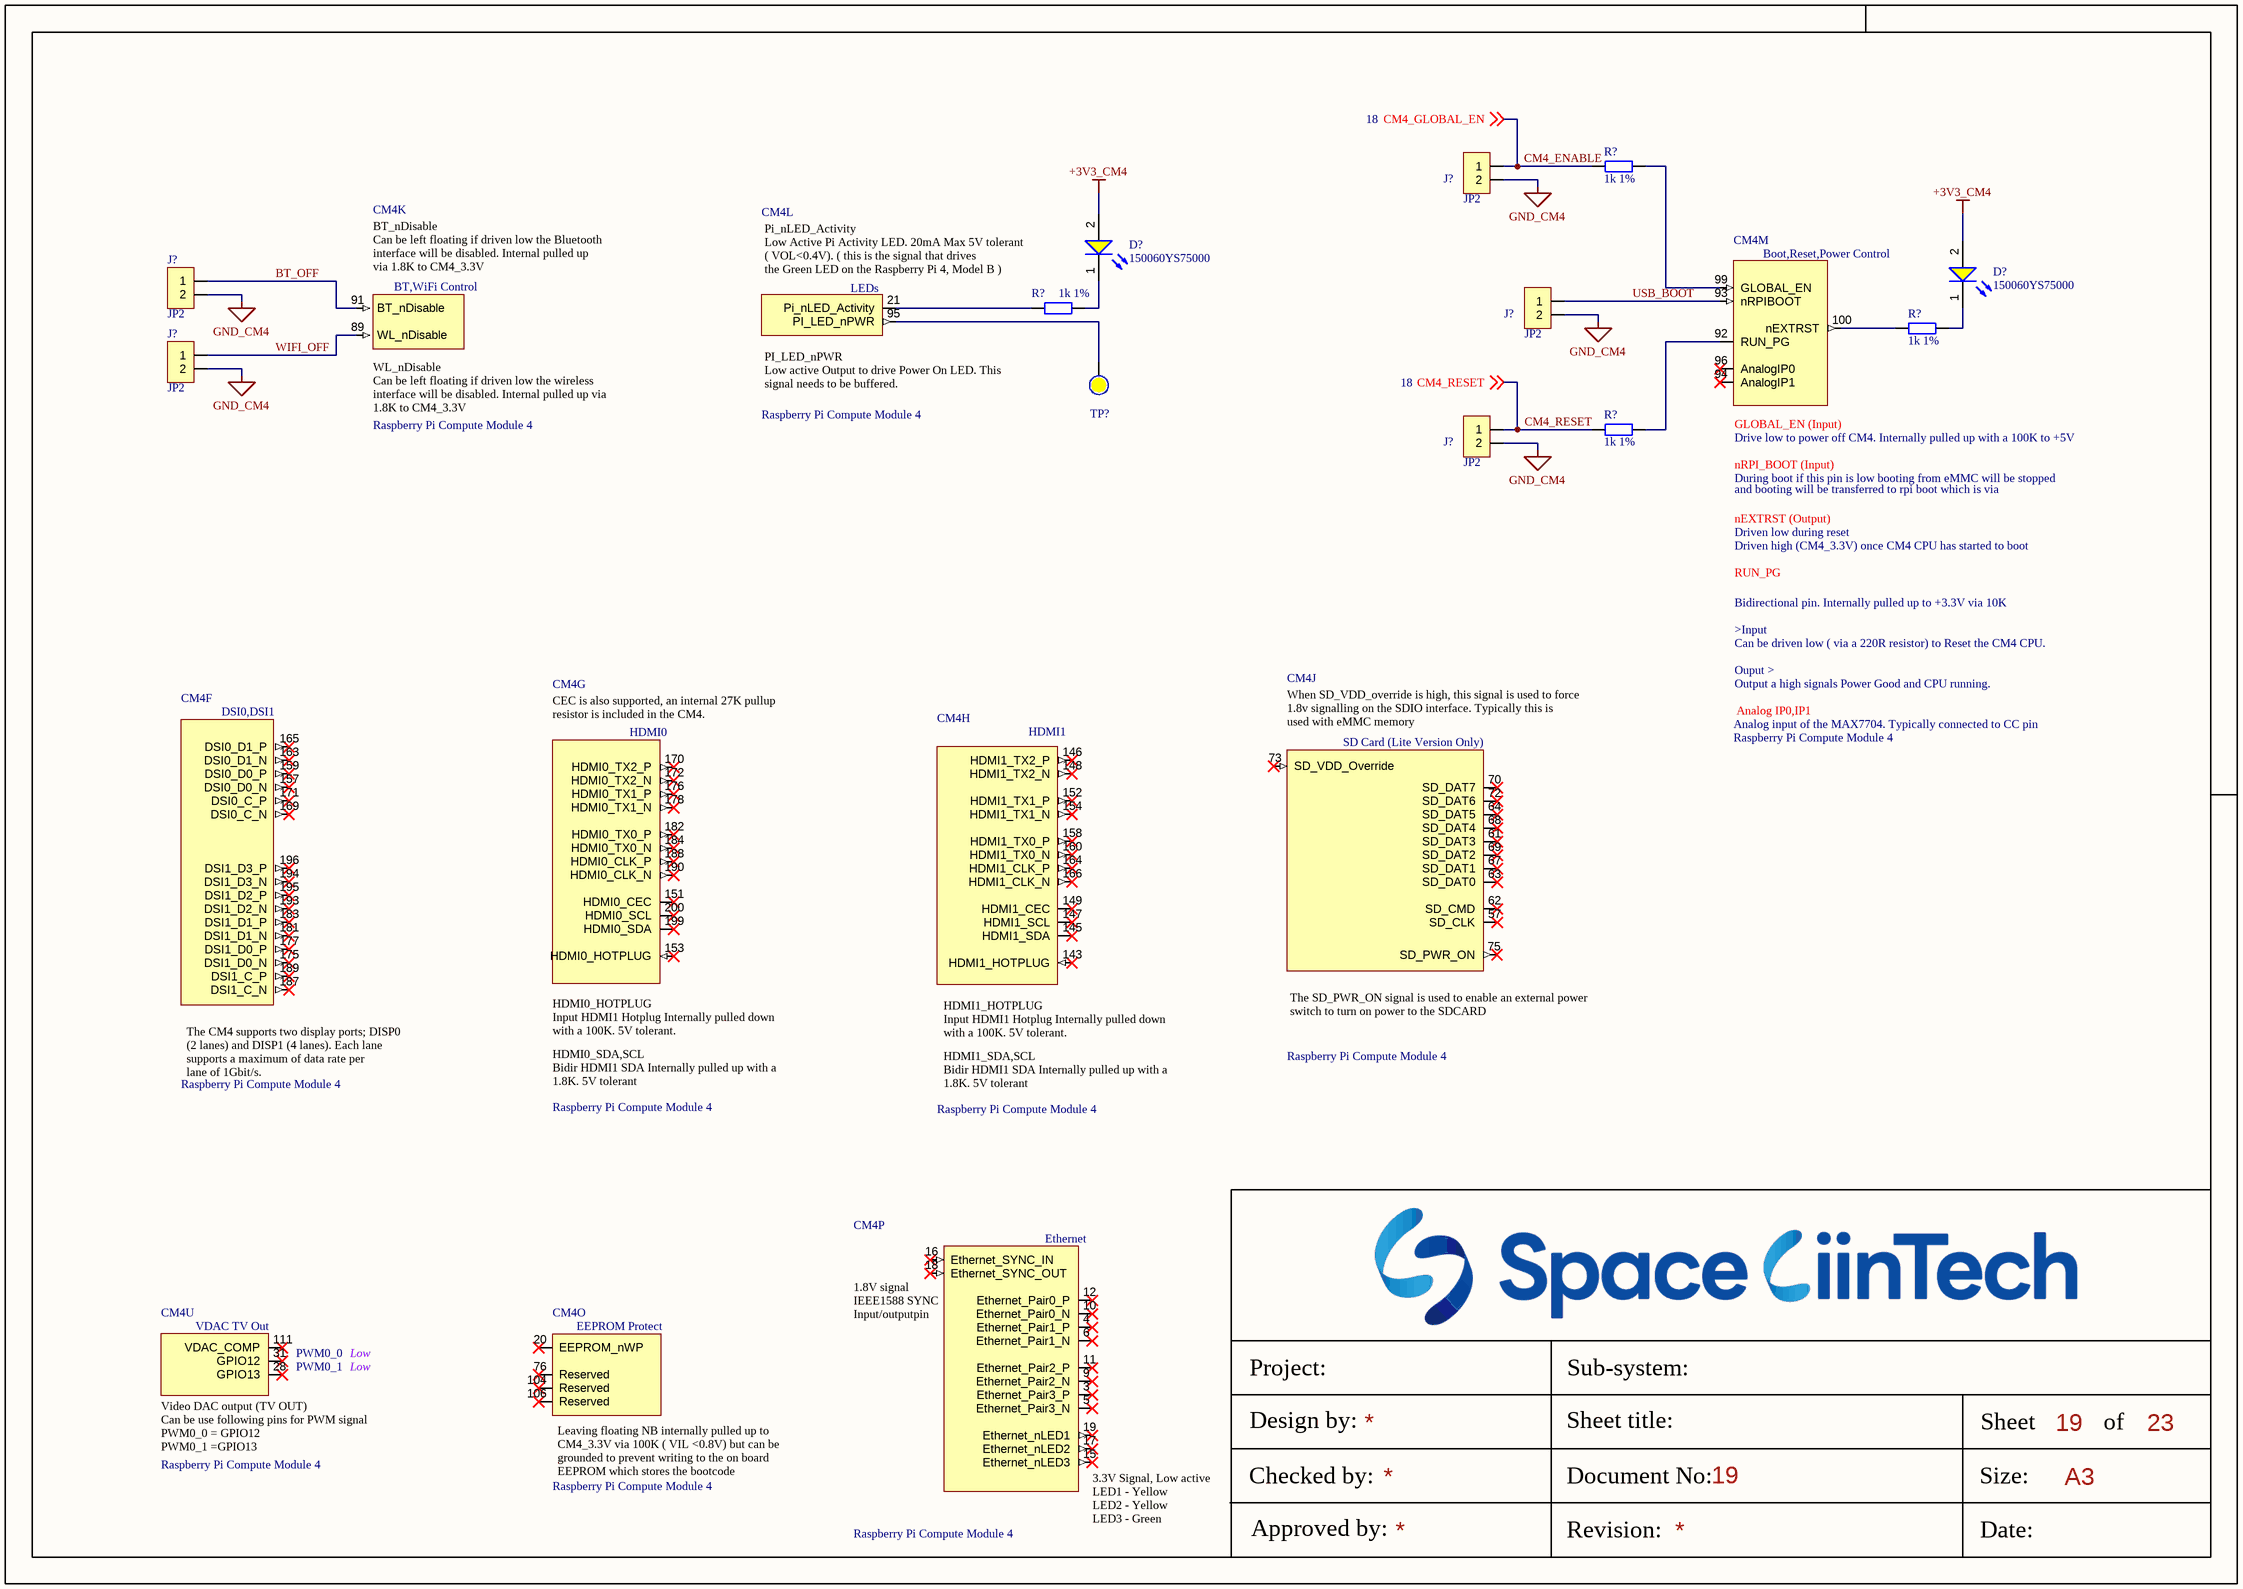
[diagram p19: obc-v2_CM4-FUNCTION.SchDoc]

### Parts
(Parts that share a designator on the sheet are numbered #1, #2 ... from top to bottom, then left to right.)
CM4  Raspberry Pi Compute Module 4  [CM4-DF40HC(3.0)-100DS-0.4v_3mm_1.5mm]  (parts F,G,H,J,K,L,M,O,P,U of 21)  (no BOM)
D?#15  150060YS75000  [WL-SMCW_0603_150060xx75000]
D?#16  150060YS75000  [WL-SMCW_0603_150060xx75000]
J?#23  JP2  [JP2-D1T]
J?#24  JP2  [JP2-D1T]
J?#25  JP2  [JP2-D1T]
J?#26  JP2  [JP2-D1T]
J?#27  JP2  [JP2-D1T]
R?#80  1k 1%  [tro smd 0603]
R?#81  1k 1%  [tro smd 0603]
R?#82  1k 1%  [tro smd 0603]
R?#83  1k 1%  [tro smd 0603]
TP?#6  (no value)  [Test Point 1 Side]  (no BOM)

### Nets
+3V3_CM4: D?#15.2(A) D?#16.2(A)
GND_CM4: J?#23.2 J?#24.2 J?#25.2 J?#26.2 J?#27.2  [project net +3V3_M2]
BT_OFF: CM4.91(BT_nDisable) J?#24.1
CM4_ENABLE: J?#23.1 R?#80.2 ; off-sheet CM4_GLOBAL_EN  [also labelled CM4_GLOBAL_EN]
CM4_RESET: J?#27.1 R?#83.2 ; off-sheet CM4_RESET
USB_BOOT: CM4.93(nRPIBOOT) J?#25.1
WIFI_OFF: CM4.89(WL_nDisable) J?#26.1
NetCM4_21: CM4.21(Pi_nLED_Activity) R?#81.2
NetCM4_92: CM4.92(RUN_PG) R?#83.1
NetCM4_95: CM4.95(PI_LED_nPWR) TP?#6.0
NetCM4_99: CM4.99(GLOBAL_EN) R?#80.1
NetCM4_100: CM4.100(nEXTRST) R?#82.2
NetD?#15_1: D?#15.1(K) R?#81.1
NetD?#16_1: D?#16.1(K) R?#82.1

Not connected (* = marked no-connect by the designer): CM4 3(Ethernet_Pair3_P)* 4(Ethernet_Pair1_P)* 5(Ethernet_Pair3_N)* 6(Ethernet_Pair1_N)* 9(Ethernet_Pair2_N)* 10(Ethernet_Pair0_N)* 11(Ethernet_Pair2_P)* 12(Ethernet_Pair0_P)* 15(Ethernet_nLED3)* 16(Ethernet_SYNC_IN)* 17(Ethernet_nLED2)* 18(Ethernet_SYNC_OUT)* 19(Ethernet_nLED1)* 20(EEPROM_nWP)* 28(GPIO13)* 31(GPIO12)* 57(SD_CLK)* 61(SD_DAT3)* 62(SD_CMD)* 63(SD_DAT0)* 64(SD_DAT5)* 67(SD_DAT1)* 68(SD_DAT4)* 69(SD_DAT2)* 70(SD_DAT7)* 72(SD_DAT6)* 73(SD_VDD_Override)* 75(SD_PWR_ON)* 76(Reserved)* 94(AnalogIP1)* 96(AnalogIP0)* 104(Reserved)* 106(Reserved)* 111(VDAC_COMP)* 143(HDMI1_HOTPLUG)* 145(HDMI1_SDA)* 146(HDMI1_TX2_P)* 147(HDMI1_SCL)* 148(HDMI1_TX2_N)* 149(HDMI1_CEC)* 151(HDMI0_CEC)* 152(HDMI1_TX1_P)* 153(HDMI0_HOTPLUG)* 154(HDMI1_TX1_N)* 157(DSI0_D0_N)* 158(HDMI1_TX0_P)* 159(DSI0_D0_P)* 160(HDMI1_TX0_N)* 163(DSI0_D1_N)* 164(HDMI1_CLK_P)* 165(DSI0_D1_P)* 166(HDMI1_CLK_N)* 169(DSI0_C_N)* 170(HDMI0_TX2_P)* 171(DSI0_C_P)* 172(HDMI0_TX2_N)* 175(DSI1_D0_N)* 176(HDMI0_TX1_P)* 177(DSI1_D0_P)* 178(HDMI0_TX1_N)* 181(DSI1_D1_N)* 182(HDMI0_TX0_P)* 183(DSI1_D1_P)* 184(HDMI0_TX0_N)* 187(DSI1_C_N)* 188(HDMI0_CLK_P)* 189(DSI1_C_P)* 190(HDMI0_CLK_N)* 193(DSI1_D2_N)* 194(DSI1_D3_N)* 195(DSI1_D2_P)* 196(DSI1_D3_P)* 199(HDMI0_SDA)* 200(HDMI0_SCL)*

### Notes on the sheet
- Project:
- Sub-system:
- Design by:
- Sheet title:
- Sheet
- A3
- of
- Checked by:
- Approved by:
- Revision:
- Document No:
- Size:
- Date:
- (in symbol CM4, part F) DSI0,DSI1; The CM4 supports two display ports; DISP0 (2 lanes) and DISP1 (4 lanes). Each lane supports a maximum of data rate per / lane of 1Gbit/s.
- (in symbol CM4, part G) HDMI0; CEC is also supported, an internal 27K pullup resistor is included in the CM4.; HDMI0_HOTPLUG / Input HDMI1 Hotplug Internally pulled down with a 100K. 5V tolerant.; HDMI0_SDA,SCL / Bidir HDMI1 SDA Internally pulled up with a 1.8K. 5V tolerant
- (in symbol CM4, part H) HDMI1; HDMI1_HOTPLUG / Input HDMI1 Hotplug Internally pulled down with a 100K. 5V tolerant.; HDMI1_SDA,SCL / Bidir HDMI1 SDA Internally pulled up with a 1.8K. 5V tolerant
- (in symbol CM4, part J) When SD_VDD_override is high, this signal is used to force 1.8v signalling on the SDIO interface. Typically this is / used with eMMC memory; SD Card (Lite Version Only); by Amornthep Phunsin; The SD_PWR_ON signal is used to enable an external power switch to turn on power to the SDCARD
- (in symbol CM4, part K) BT_nDisable / Can be left floating if driven low the Bluetooth interface will be disabled. Internal pulled up / via 1.8K to CM4_3.3V; BT,WiFi Control; WL_nDisable / Can be left floating if driven low the wireless interface will be disabled. Internal pulled up via / 1.8K to CM4_3.3V
- (in symbol CM4, part L) Pi_nLED_Activity / Low Active Pi Activity LED. 20mA Max 5V tolerant ( VOL<0.4V). ( this is the signal that drives / the Green LED on the Raspberry Pi 4, Model B ); LEDs; PI_LED_nPWR / Low active Output to drive Power On LED. This signal needs to be buffered.
- (in symbol CM4, part M) Boot,Reset,Power Control; GLOBAL_EN (Input); Drive low to power off CM4. Internally pulled up with a 100K to +5V; nRPI_BOOT (Input); During boot if this pin is low booting from eMMC will be stopped; and booting will be transferred to rpi boot which is via; nEXTRST (Output); Driven low during reset; Driven high (CM4_3.3V) once CM4 CPU has started to boot; Bidirectional pin. Internally pulled up to +3.3V via 10K / >Input / Can be driven low ( via a 220R resistor) to Reset the CM4 CPU. / Ouput > / Output a high signals Power Good and CPU running.; Analog IP0,IP1; Analog input of the MAX7704. Typically connected to CC pin
- (in symbol CM4, part O) EEPROM Protect; Leaving floating NB internally pulled up to CM4_3.3V via 100K ( VIL <0.8V) but can be / grounded to prevent writing to the on board EEPROM which stores the bootcode
- (in symbol CM4, part P) Ethernet; 1.8V signal / IEEE1588 SYNC Input/outputpin; by Amornthep Phunsin; 3.3V Signal, Low active / LED1 - Yellow / LED2 - Yellow / LED3 - Green
- (in symbol CM4, part U) VDAC TV Out; PWM0_0; Low; PWM0_1; Video DAC output (TV OUT) / Can be use following pins for PWM signal / PWM0_0 = GPIO12 / PWM0_1 =GPIO13

### Library data of the parts
CM4 = CM4: as CM4 on sheet obc-v2_CM4-PinOut
D?#15 D?#16 = CMP-1426-00005-2: as D?#12-D?#14 on sheet obc-v2_CM4-PinOut; Case Code (Imperial): 0603; Height: 700µm; REACH SVHC: Unknown; Dominant Wavelength: 590nm; Min Operating Temperature: -40°C; Color: Yellow; Width: 800µm; Mount: Surface Mount; Packaging: Tape and Reel; Max Operating Temperature: 85°C; RoHS: Compliant; Max Reverse Voltage (DC): 5V; Case Code (Metric): 1608; Length: 1.6mm; Case/Package: 0603
J?#23-J?#27 = JP2: as J?#20 on sheet obc-v2_CM4-PinOut; Created Date: 29 March 2013; ComponentLink1URL: http://www.we-online.com; ComponentLink2URL: http://katalog.we-online.de/em/datasheet/6130xx143121.pdf; Created by: Karrer Zheng
R?#80-R?#83 = Tro 0603 1% 10k: as R?#63-R?#68 on sheet obc-v2_CM4-PinOut; Kieu_Chan: *
TP?#6 = Test Point: Solder: NF

## Sheet obc-v2_CM4-CSI.SchDoc
size 420 x 297 mm; SheetNumber: 20; SheetTotal: 23
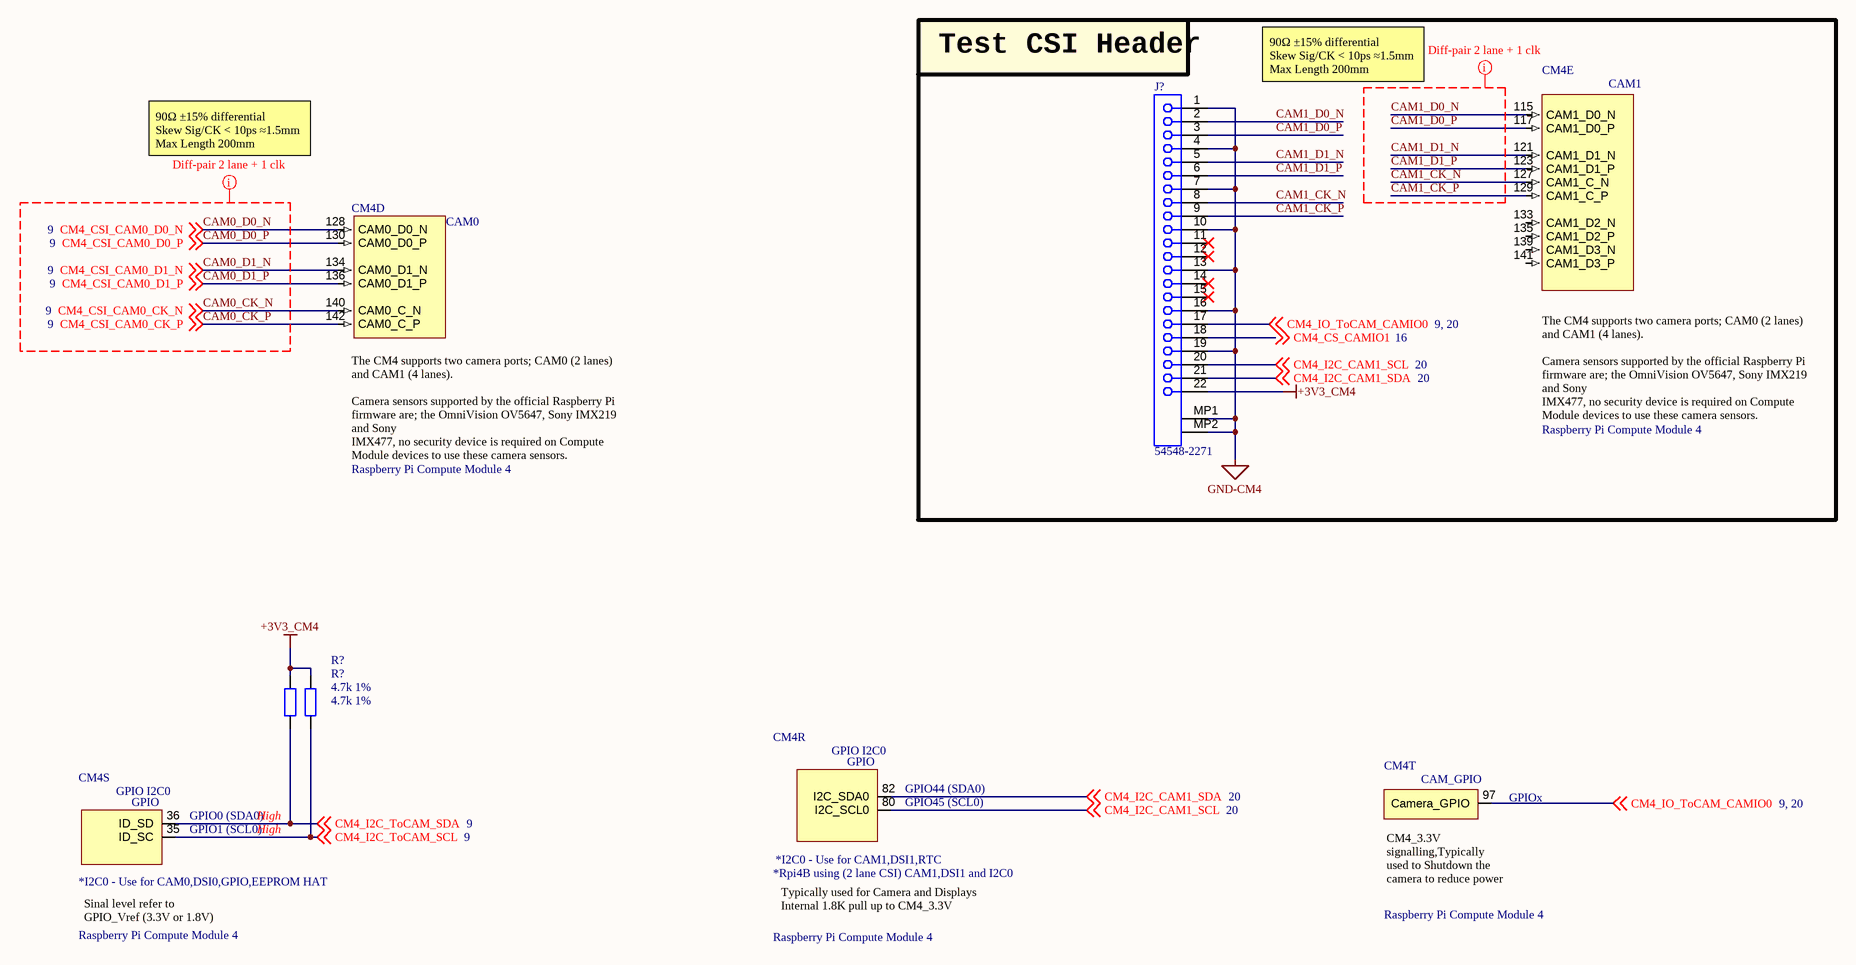
[diagram p20: obc-v2_CM4-CSI.SchDoc]

### Parts
(Parts that share a designator on the sheet are numbered #1, #2 ... from top to bottom, then left to right.)
CM4  Raspberry Pi Compute Module 4  [CM4-DF40HC(3.0)-100DS-0.4v_3mm_1.5mm]  (parts D,E,R,S,T of 21)  (no BOM)
J?#28  54548-2271  [MOLX-54548-2271]
R?#84  4.7k 1%  [tro smd 0603]
R?#85  4.7k 1%  [tro smd 0603]

### Blocks framed on the sheet
Test CSI Header: CM4 J?#28

### Nets
+3V3_CM4: J?#28.22 R?#84.1 R?#85.1
GND-CM4: J?#28.1 J?#28.4 J?#28.7 J?#28.10 J?#28.13 J?#28.16 J?#28.19 J?#28.MP1 J?#28.MP2
CAM0_CK_N: CM4.140(CAM0_C_N) ; off-sheet CM4_CSI_CAM0_CK_N  [also labelled CM4_CSI_CAM0_CK_N]
CAM0_CK_P: CM4.142(CAM0_C_P) ; off-sheet CM4_CSI_CAM0_CK_P  [also labelled CM4_CSI_CAM0_CK_P]
CAM0_D0_N: CM4.128(CAM0_D0_N) ; off-sheet CM4_CSI_CAM0_D0_N  [also labelled CM4_CSI_CAM0_D0_N]
CAM0_D0_P: CM4.130(CAM0_D0_P) ; off-sheet CM4_CSI_CAM0_D0_P  [also labelled CM4_CSI_CAM0_D0_P]
CAM0_D1_N: CM4.134(CAM0_D1_N) ; off-sheet CM4_CSI_CAM0_D1_N  [also labelled CM4_CSI_CAM0_D1_N]
CAM0_D1_P: CM4.136(CAM0_D1_P) ; off-sheet CM4_CSI_CAM0_D1_P  [also labelled CM4_CSI_CAM0_D1_P]
CAM1_CK_N: CM4.127(CAM1_C_N) J?#28.8
CAM1_CK_P: CM4.129(CAM1_C_P) J?#28.9
CAM1_D0_N: CM4.115(CAM1_D0_N) J?#28.2
CAM1_D0_P: CM4.117(CAM1_D0_P) J?#28.3
CAM1_D1_N: CM4.121(CAM1_D1_N) J?#28.5
CAM1_D1_P: CM4.123(CAM1_D1_P) J?#28.6
CM4_CS_CAMIO1: J?#28.18 ; off-sheet CM4_CS_CAMIO1
CM4_I2C_CAM1_SCL: CM4.80(I2C_SCL0) J?#28.20 ; off-sheet CM4_I2C_CAM1_SCL
CM4_I2C_CAM1_SDA: CM4.82(I2C_SDA0) J?#28.21 ; off-sheet CM4_I2C_CAM1_SDA
CM4_I2C_ToCAM_SCL: CM4.35(ID_SC) R?#85.2 ; off-sheet CM4_I2C_ToCAM_SCL
CM4_I2C_ToCAM_SDA: CM4.36(ID_SD) R?#84.2 ; off-sheet CM4_I2C_ToCAM_SDA
CM4_IO_ToCAM_CAMIO0: CM4.97(Camera_GPIO) J?#28.17 ; off-sheet CM4_IO_ToCAM_CAMIO0

Not connected (* = marked no-connect by the designer): CM4 133(CAM1_D2_N) 135(CAM1_D2_P) 139(CAM1_D3_N) 141(CAM1_D3_P); J?#28 11* 12* 14* 15*

### Layout directives
mark named Diff-pair 2 lane + 1 clk: CAM0_CK_N, CAM0_CK_P, CAM0_D0_N, CAM0_D0_P, CAM0_D1_N, CAM0_D1_P, CAM1_CK_N, CAM1_CK_P, CAM1_D0_N, CAM1_D0_P, CAM1_D1_N, CAM1_D1_P, CM4_CSI_CAM0_CK_N, CM4_CSI_CAM0_CK_P, CM4_CSI_CAM0_D0_N, CM4_CSI_CAM0_D0_P, CM4_CSI_CAM0_D1_N, CM4_CSI_CAM0_D1_P

### Notes on the sheet
- 90Ω ±15% differential
  Skew Sig/CK < 10ps ≈1.5mm
  Max Length 200mm
- Project:
- Sub-system:
- Design by:
- Sheet title:
- Sheet
- A3
- of
- Checked by:
- Approved by:
- Revision:
- Document No:
- Size:
- Date:
- (in symbol CM4, part D) CAM0; The CM4 supports two camera ports; CAM0 (2 lanes) and CAM1 (4 lanes). / Camera sensors supported by the official Raspberry Pi firmware are; the OmniVision OV5647, Sony IMX219 and Sony / IMX477, no security device is required on Compute Module devices to use these camera sensors.
- (in symbol CM4, part E) CAM1; The CM4 supports two camera ports; CAM0 (2 lanes) and CAM1 (4 lanes). / Camera sensors supported by the official Raspberry Pi firmware are; the OmniVision OV5647, Sony IMX219 and Sony / IMX477, no security device is required on Compute Module devices to use these camera sensors.
- (in symbol CM4, part R) GPIO I2C0; GPIO; GPIO44 (SDA0); GPIO45 (SCL0); *I2C0 - Use for CAM1,DSI1,RTC; *Rpi4B using (2 lane CSI) CAM1,DSI1 and I2C0; Typically used for Camera and Displays Internal 1.8K pull up to CM4_3.3V
- (in symbol CM4, part S) GPIO I2C0; GPIO; GPIO0 (SDA0); High; GPIO1 (SCL0); *I2C0 - Use for CAM0,DSI0,GPIO,EEPROM HAT; Sinal level refer to  GPIO_Vref (3.3V or 1.8V)
- (in symbol CM4, part T) CAM_GPIO; GPIOx; CM4_3.3V signalling,Typically used to Shutdown the camera to reduce power

### Library data of the parts
CM4 = CM4: as CM4 on sheet obc-v2_CM4-PinOut
J?#28 = CMP-1241-00555-1: 0.5 mm Pitch Easy-On(TM) Type FPC Connector, 1.2 mm Mated Height, Right Angle, ZIF, SMT, Bottom Contact, 22 Circuits, -20 to 85 degC, ELV and RoHS Compliant, Tape and Reel; Manufacturer: Molex; Circuits (Loaded): 22; Stackable: No; Material - Plating Termination: Tin; PCB Retention: Yes; Entry Angle: 90degrees Angle; Material - Plating Mating: Gold; Current (Max per Contact): 0.5A; Material - Metal: Phosphor Bronze; Voltage (Max): 50V; Mated Height: 1.20mm; Pitch - Mating Interface: 0.50mm; Durability (mating cycles max): 20; PackageVersion: Rev. N, 06/2008; PackageDescription: 22-Lead FPC Connector, Pitch 0.5 mm; PackageReference: 54548-2271; ComponentLink2Description: Datasheet; PartNumber: 54548-2271; ComponentLink3URL: http://www.molex.com/pdm_docs/sd/545482171_sd.pdf; Contact Position: Bottom; Packing: Tape and Reel; ComponentLink1URL: http://www.molex.com/molex/index.jsp; Mounting Technology: Surface Mount; ComponentLink3Description: Package Specification; PCB Locator: No; ComponentLink2URL: http://www.molex.com/webdocs/datasheets/pdf/en-us/0545482271_FFC_FPC_CONNECTORS.pdf; Orientation: Right Angle; Number of Rows: 1; RoHS: TRUE; Polarized to PCB: Yes; ComponentLink1Description: Manufacturer URL
R?#84 R?#85 = Tro 0603 1% 10k: as R?#63-R?#68 on sheet obc-v2_CM4-PinOut; Kieu_Chan: *

## Sheet obc-v2_CM4-POWER.SchDoc
size 420 x 297 mm; SheetNumber: 21; SheetTotal: 23
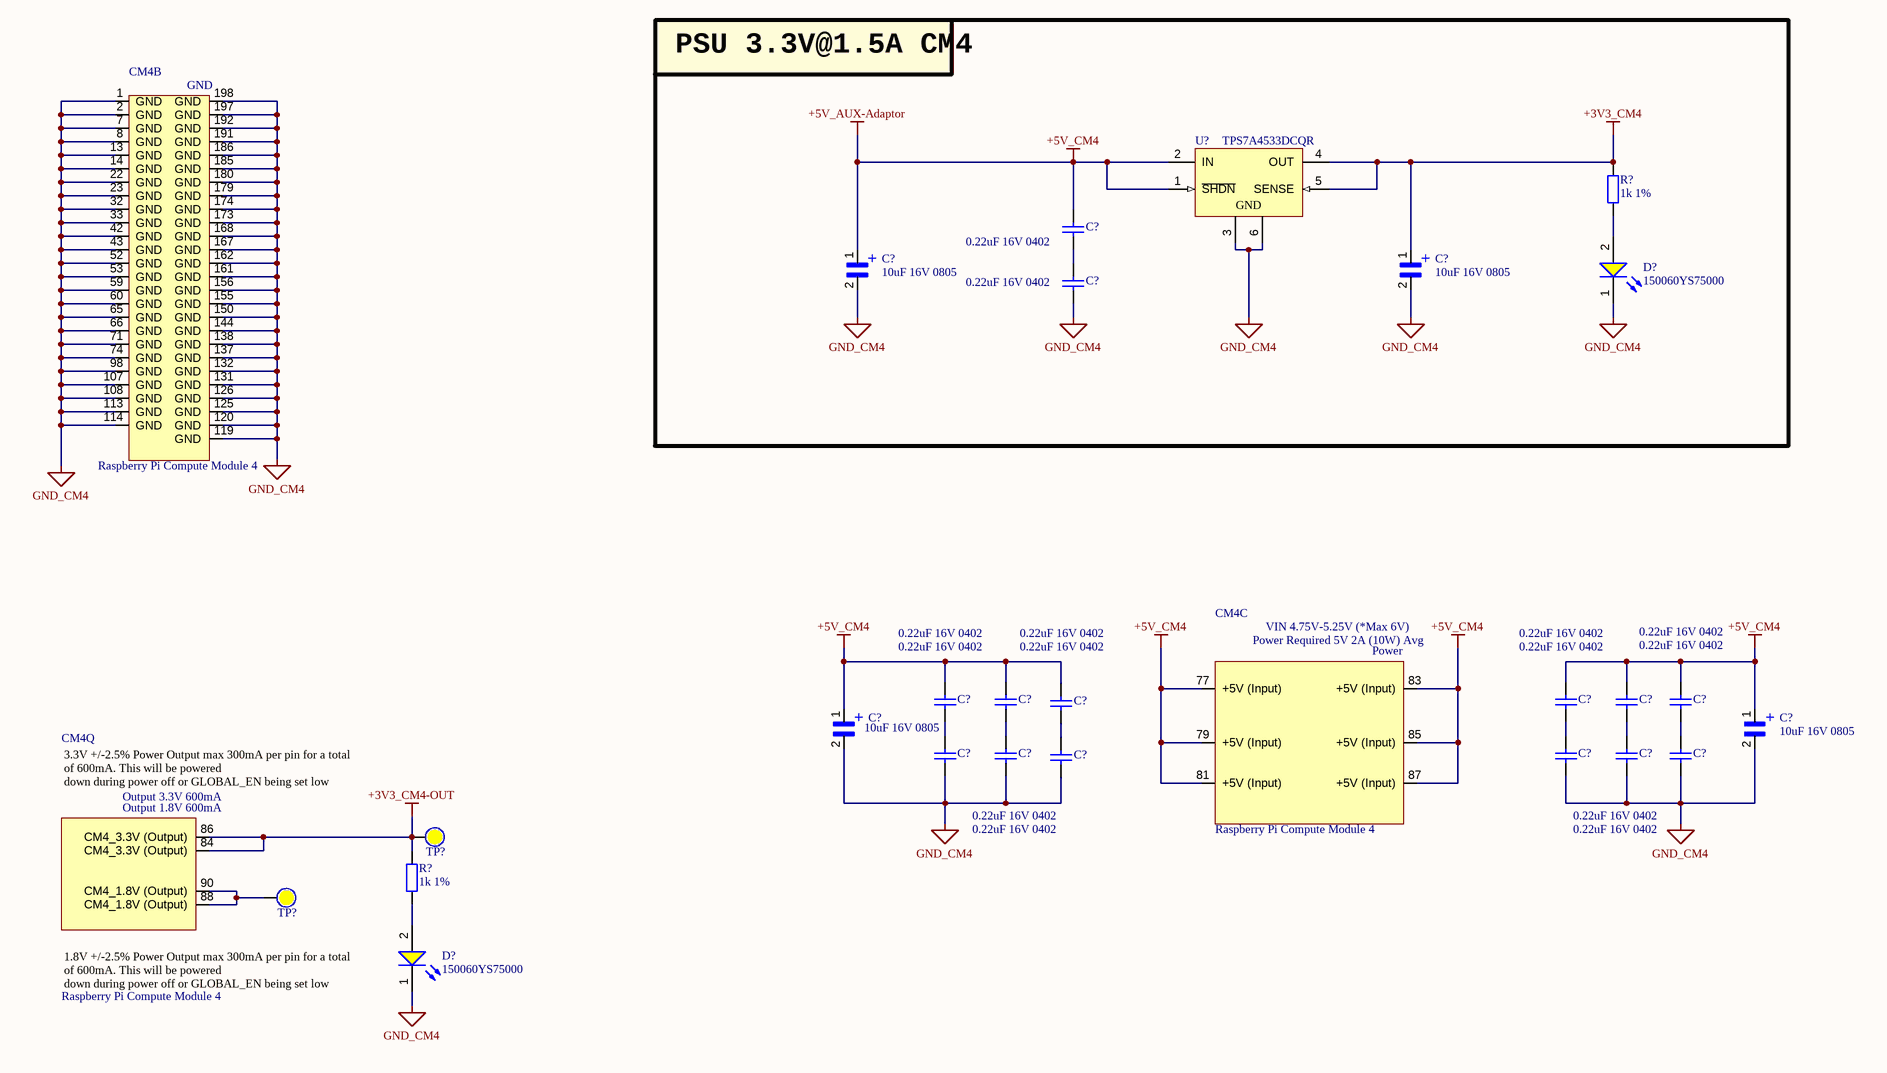
[diagram p21: obc-v2_CM4-POWER.SchDoc]

### Parts
(Parts that share a designator on the sheet are numbered #1, #2 ... from top to bottom, then left to right.)
C?#162  0.22uF 16V 0402  [tu 0402]
C?#163  10uF 16V 0805  [CAPC2012X140N]
C?#164  10uF 16V 0805  [CAPC2012X140N]
C?#165  0.22uF 16V 0402  [tu 0402]
C?#166  0.22uF 16V 0402  [tu 0402]
C?#167  0.22uF 16V 0402  [tu 0402]
C?#168  0.22uF 16V 0402  [tu 0402]
C?#169  0.22uF 16V 0402  [tu 0402]
C?#170  0.22uF 16V 0402  [tu 0402]
C?#171  0.22uF 16V 0402  [tu 0402]
C?#172  10uF 16V 0805  [CAPC2012X140N]
C?#173  10uF 16V 0805  [CAPC2012X140N]
C?#174  0.22uF 16V 0402  [tu 0402]
C?#175  0.22uF 16V 0402  [tu 0402]
C?#176  0.22uF 16V 0402  [tu 0402]
C?#177  0.22uF 16V 0402  [tu 0402]
C?#178  0.22uF 16V 0402  [tu 0402]
C?#179  0.22uF 16V 0402  [tu 0402]
CM4  Raspberry Pi Compute Module 4  [CM4-DF40HC(3.0)-100DS-0.4v_3mm_1.5mm]  (parts B,C,Q of 21)  (no BOM)
D?#17  150060YS75000  [WL-SMCW_0603_150060xx75000]
D?#18  150060YS75000  [WL-SMCW_0603_150060xx75000]
R?#86  1k 1%  [tro smd 0603]
R?#87  1k 1%  [tro smd 0603]
TP?#7  (no value)  [Test Point 1 Side]  (no BOM)
TP?#8  (no value)  [Test Point 1 Side]  (no BOM)
U?#28  TPS7A4533DCQR  [DCQ0006A_M]

### Blocks framed on the sheet
PSU 3.3V@1.5A CM4: C?#162-C?#165 D?#17 R?#86 U?#28

### Nets
+3V3_CM4: C?#164.1 R?#86.2 U?#28.4(OUT) U?#28.5(SENSE)
+3V3_CM4-OUT: CM4.84(CM4_3.3V_(Output)) CM4.86(CM4_3.3V_(Output)) R?#87.2 TP?#7.0
+5V_AUX-Adaptor: C?#162.1 C?#163.1 C?#166.1 C?#167.1 C?#168.1 C?#169.1 C?#170.1 C?#171.1 C?#172.1 C?#173.1 CM4.77(+5V_(Input)) CM4.79(+5V_(Input)) CM4.81(+5V_(Input)) CM4.83(+5V_(Input)) CM4.85(+5V_(Input)) CM4.87(+5V_(Input)) U?#28.1(~{SHDN}) U?#28.2(IN)  [also labelled +5V_CM4]
GND_CM4: C?#163.2 C?#164.2 C?#165.2 C?#172.2 C?#173.2 C?#174.2 C?#175.2 C?#176.2 C?#177.2 C?#178.2 C?#179.2 CM4.1(GND) CM4.2(GND) CM4.7(GND) CM4.8(GND) CM4.13(GND) CM4.14(GND) CM4.22(GND) CM4.23(GND) CM4.32(GND) CM4.33(GND) CM4.42(GND) CM4.43(GND) CM4.52(GND) CM4.53(GND) CM4.59(GND) CM4.60(GND) CM4.65(GND) CM4.66(GND) CM4.71(GND) CM4.74(GND) CM4.98(GND) CM4.107(GND) CM4.108(GND) CM4.113(GND) CM4.114(GND) CM4.119(GND) CM4.120(GND) CM4.125(GND) CM4.126(GND) CM4.131(GND) CM4.132(GND) CM4.137(GND) CM4.138(GND) CM4.144(GND) CM4.150(GND) CM4.155(GND) CM4.156(GND) CM4.161(GND) CM4.162(GND) CM4.167(GND) CM4.168(GND) CM4.173(GND) CM4.174(GND) CM4.179(GND) CM4.180(GND) CM4.185(GND) CM4.186(GND) CM4.191(GND) CM4.192(GND) CM4.197(GND) CM4.198(GND) D?#17.1(K) D?#18.1(K) U?#28.3(GND) U?#28.6(GND)  [project net +3V3_M2]
NetC?#162_2: C?#162.2 C?#165.1
NetC?#166_2: C?#166.2 C?#174.1
NetC?#167_2: C?#167.2 C?#175.1
NetC?#168_2: C?#168.2 C?#176.1
NetC?#169_2: C?#169.2 C?#177.1
NetC?#170_2: C?#170.2 C?#178.1
NetC?#171_2: C?#171.2 C?#179.1
NetCM4_88: CM4.88(CM4_1.8V_(Output)) CM4.90(CM4_1.8V_(Output)) TP?#8.0
NetD?#17_2: D?#17.2(A) R?#86.1
NetD?#18_2: D?#18.2(A) R?#87.1

### Notes on the sheet
- Project:
- Sub-system:
- Design by:
- Sheet title:
- Sheet
- A3
- of
- Checked by:
- Approved by:
- Revision:
- Document No:
- Size:
- Date:
- (in symbol CM4, part C) VIN 4.75V-5.25V (*Max 6V); Power Required 5V 2A (10W) Avg; Power; by Amornthep Phunsin
- (in symbol CM4, part Q) 3.3V +/-2.5% Power Output max 300mA per pin for a total of 600mA. This will be powered / down during power off or GLOBAL_EN being set low; Output 3.3V 600mA; Output 1.8V 600mA; 1.8V +/-2.5% Power Output max 300mA per pin for a total of 600mA. This will be powered / down during power off or GLOBAL_EN being set low
- (in symbol TACR686M003RTA) +

### Library data of the parts
C?#162 C?#165-C?#171 C?#174-C?#179 = Tu 0402 33nF 10V: as C?#128-C?#141 on sheet obc-v2_CM4-PinOut; Kieu_Chan: *
C?#163 C?#164 C?#172 C?#173 = TACR686M003RTA: 10 µF Molded Tantalum Capacitors 16 V 0805 (2012 Metric) 8Ohm @ 100kHz: TP8R106M016C; MF: AVX; Availability: Unavailable; SnapEDA_Link: https://www.snapeda.com/parts/TACR686M003RTA/AVX/view-part/1745975/?ref=snap; MP: TACR686M003RTA; Value: *; Price: None; Package: 0805 AVX
CM4 = CM4: as CM4 on sheet obc-v2_CM4-PinOut
D?#17 D?#18 = CMP-1426-00005-2: as D?#12-D?#14 on sheet obc-v2_CM4-PinOut; Case Code (Imperial): 0603; Height: 700µm; REACH SVHC: Unknown; Dominant Wavelength: 590nm; Min Operating Temperature: -40°C; Color: Yellow; Width: 800µm; Mount: Surface Mount; Packaging: Tape and Reel; Max Operating Temperature: 85°C; RoHS: Compliant; Max Reverse Voltage (DC): 5V; Case Code (Metric): 1608; Length: 1.6mm; Case/Package: 0603
R?#86 R?#87 = Tro 0603 1% 10k: as R?#63-R?#68 on sheet obc-v2_CM4-PinOut; Kieu_Chan: *
TP?#7 TP?#8 = Test Point: Solder: NF
U?#28 = CMP-0395-00360-2: Single Output Fast Transient Response LDO, 1.5 A, Fixed 3.3 V Output, 2.1 to 20 V Input, 6-pin SOT-223 (DCQ), -40 to 125 degC, Green (RoHS & no Sb/Br); Manufacturer: Texas Instruments; Vout Adj(Max)(V): 3.3; Vin(Max)(V): 20; Accuracy(%): 1; SubFamily: Single Channel LDO; Vin(Min)(V): 2.1; Iout(Max)(A): 1.5; Vdo(Typ)(mV): 300; Eco-Plan: Green (RoHS & no Sb/Br); Mounting Technology: Surface Mount; PackageDescription: 6-Pin Plastic Small Outline, Body 3.5 x 6.5 mm, Pitch 1.27 mm; ComponentLink2URL: http://www.ti.com/general/docs/lit/getliterature.tsp?genericPartNumber=TPS7A4533&fileType=pdf; PackageReference: DCQ0006A; ComponentLink3Description: Package Specification; ComponentLink2Description: Datasheet; Fixed Output Options(V): 3.3; Iq(Typ)(mA): 1; ComponentLink1URL: http://www.ti.com/; PartNumber: TPS7A4533DCQR; ComponentLink1Description: Manufacturer URL; PackageVersion: 4202109/D; Vout Adj(Min)(V): 3.3; DatasheetVersion: SLVS720D; ComponentLink3URL: http://www.ti.com/litv/pdf/mpds098c

## Sheet obc-v2_MCU-POWER.SchDoc
size 420 x 297 mm; SheetNumber: 22; SheetTotal: 23
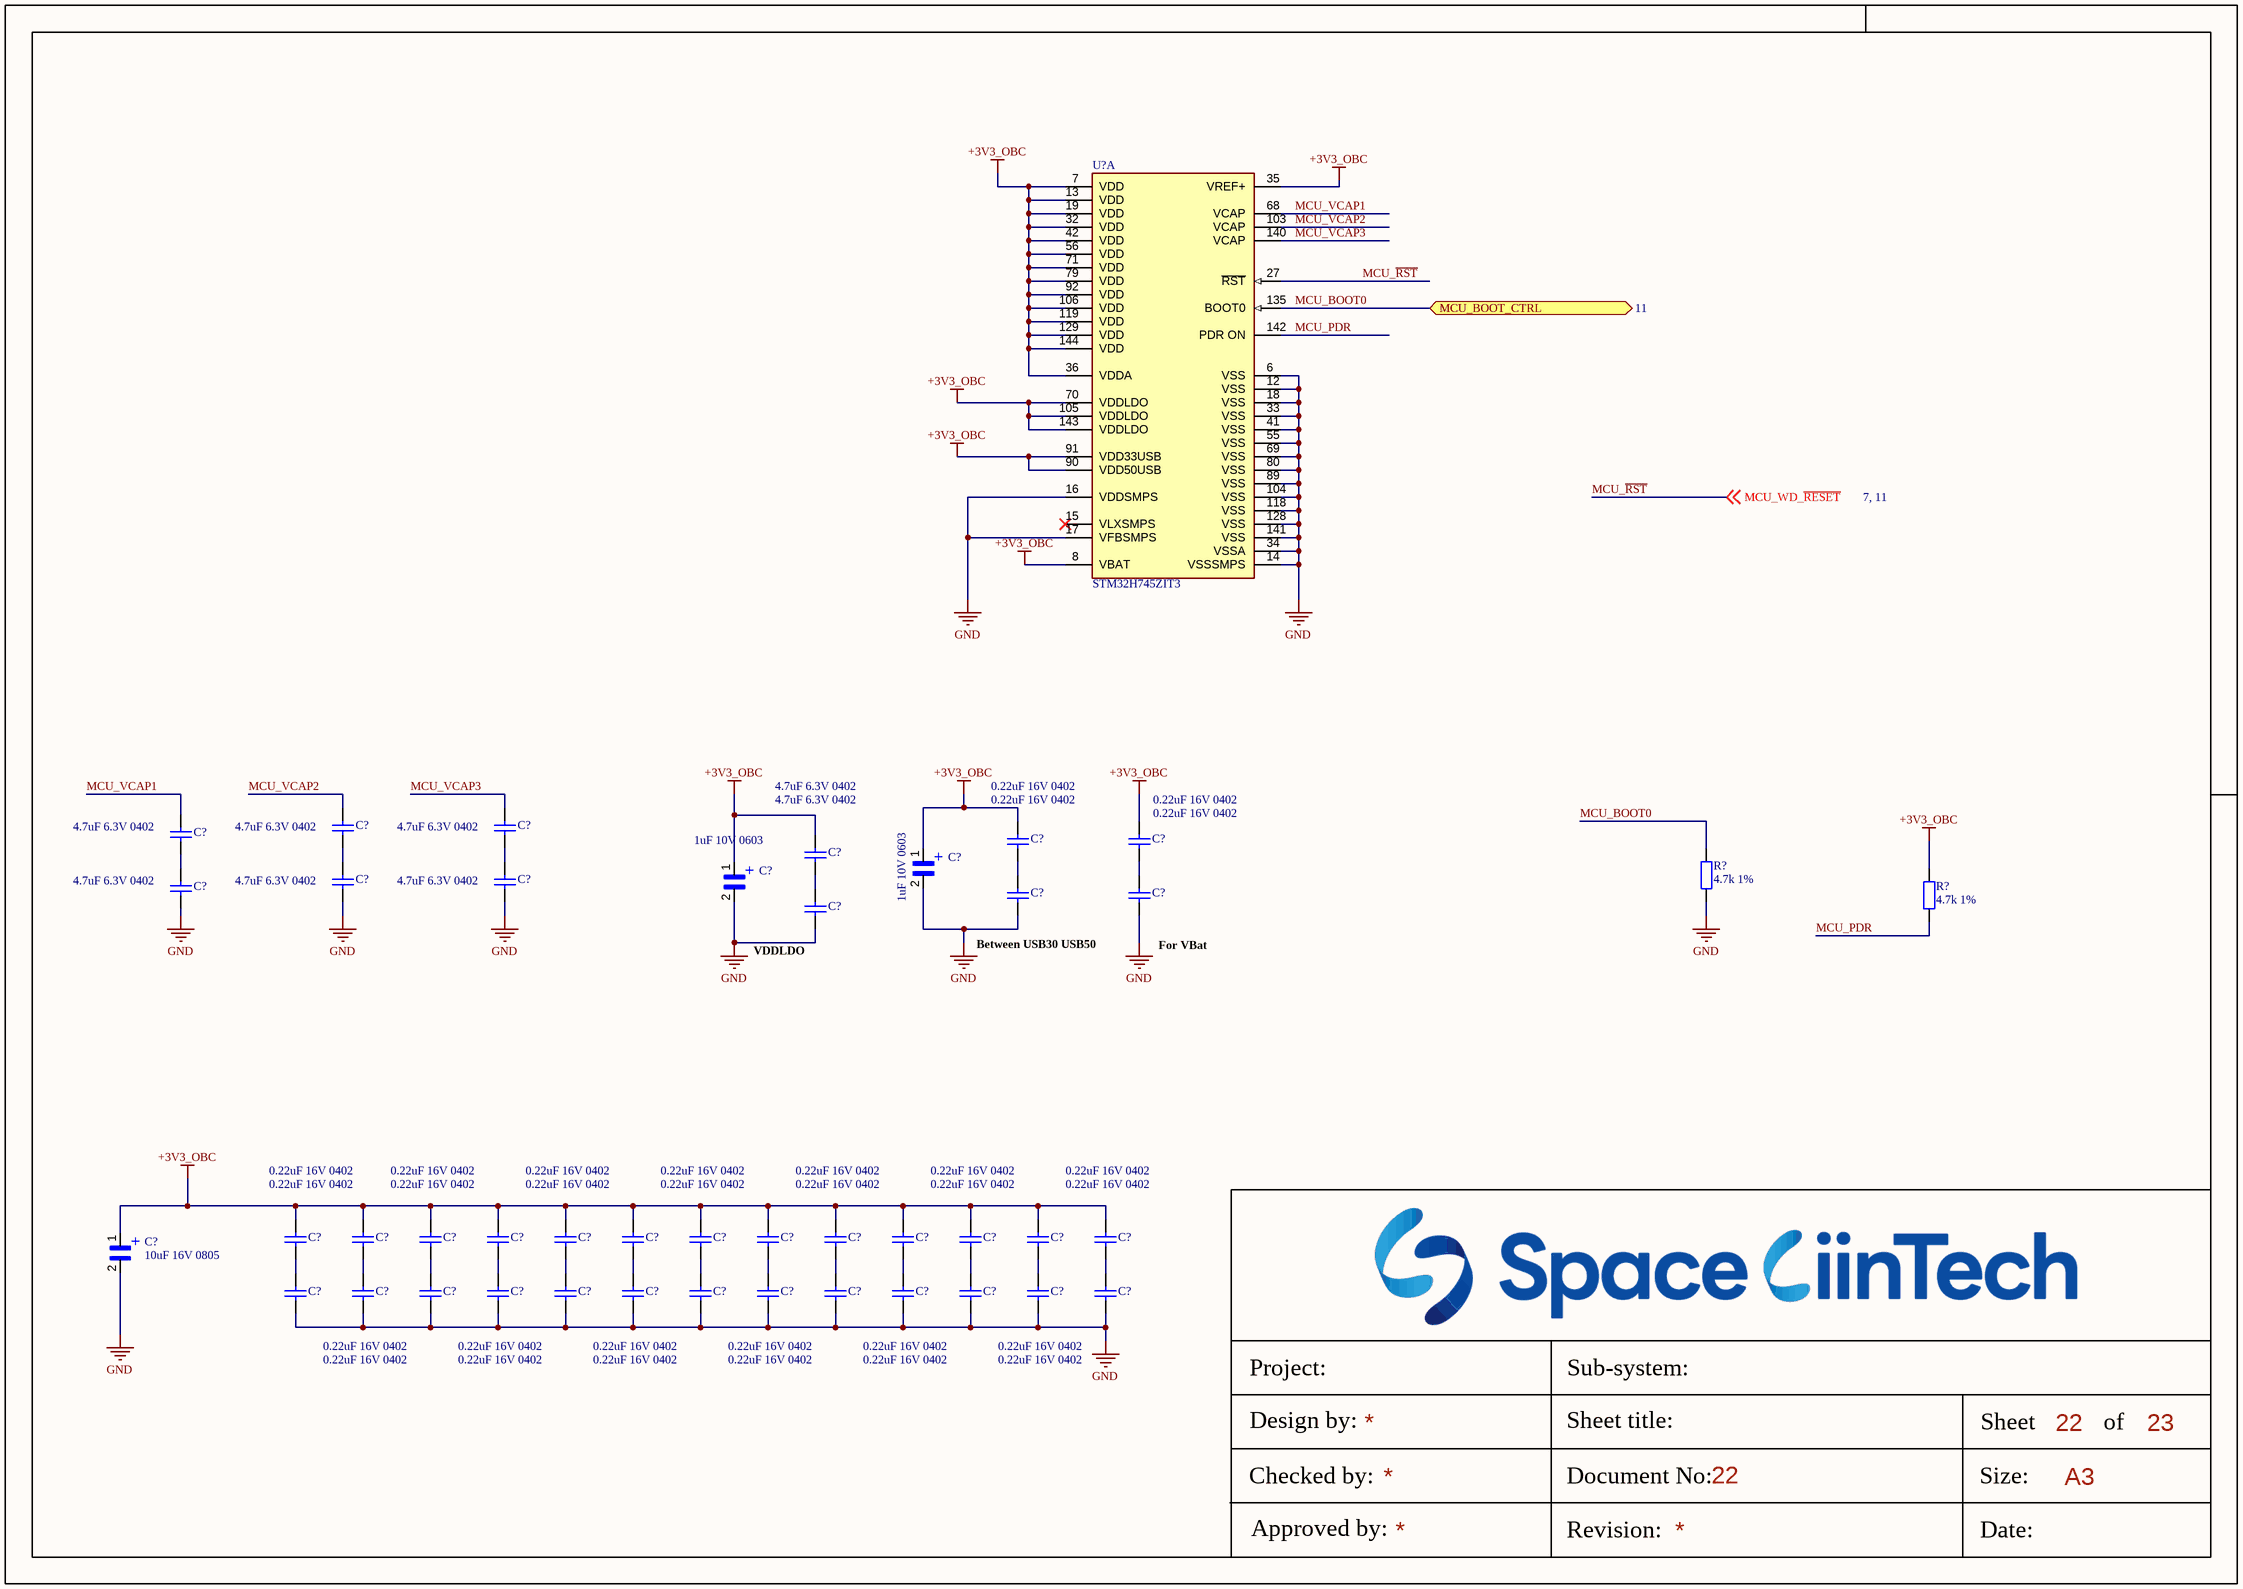
[diagram p22: obc-v2_MCU-POWER.SchDoc]

### Parts
(Parts that share a designator on the sheet are numbered #1, #2 ... from top to bottom, then left to right.)
C?#180  4.7uF 6.3V 0402  [tu 0402]
C?#181  4.7uF 6.3V 0402  [tu 0402]
C?#182  4.7uF 6.3V 0402  [tu 0402]
C?#183  0.22uF 16V 0402  [tu 0402]
C?#184  0.22uF 16V 0402  [tu 0402]
C?#185  4.7uF 6.3V 0402  [tu 0402]
C?#186  1uF 10V 0603  [CAPC1608X90]
C?#187  4.7uF 6.3V 0402  [tu 0402]
C?#188  4.7uF 6.3V 0402  [tu 0402]
C?#189  4.7uF 6.3V 0402  [tu 0402]
C?#190  1uF 10V 0603  [CAPC1608X90]
C?#191  0.22uF 16V 0402  [tu 0402]
C?#192  0.22uF 16V 0402  [tu 0402]
C?#193  4.7uF 6.3V 0402  [tu 0402]
C?#194  0.22uF 16V 0402  [tu 0402]
C?#195  0.22uF 16V 0402  [tu 0402]
C?#196  0.22uF 16V 0402  [tu 0402]
C?#197  0.22uF 16V 0402  [tu 0402]
C?#198  0.22uF 16V 0402  [tu 0402]
C?#199  0.22uF 16V 0402  [tu 0402]
C?#200  0.22uF 16V 0402  [tu 0402]
C?#201  0.22uF 16V 0402  [tu 0402]
C?#202  0.22uF 16V 0402  [tu 0402]
C?#203  0.22uF 16V 0402  [tu 0402]
C?#204  0.22uF 16V 0402  [tu 0402]
C?#205  0.22uF 16V 0402  [tu 0402]
C?#206  0.22uF 16V 0402  [tu 0402]
C?#207  10uF 16V 0805  [CAPC2012X140N]
C?#208  0.22uF 16V 0402  [tu 0402]
C?#209  0.22uF 16V 0402  [tu 0402]
C?#210  0.22uF 16V 0402  [tu 0402]
C?#211  0.22uF 16V 0402  [tu 0402]
C?#212  0.22uF 16V 0402  [tu 0402]
C?#213  0.22uF 16V 0402  [tu 0402]
C?#214  0.22uF 16V 0402  [tu 0402]
C?#215  0.22uF 16V 0402  [tu 0402]
C?#216  0.22uF 16V 0402  [tu 0402]
C?#217  0.22uF 16V 0402  [tu 0402]
C?#218  0.22uF 16V 0402  [tu 0402]
C?#219  0.22uF 16V 0402  [tu 0402]
C?#220  0.22uF 16V 0402  [tu 0402]
R?#88  4.7k 1%  [tro smd 0603]
R?#89  4.7k 1%  [tro smd 0603]
U?#29  STM32H745ZIT3  [FP-LQFP144-1A-MFG]  (part A of 3)

### Ports
MCU_BOOT_CTRL (bidir, see 11)

### Nets
+3V3_OBC: C?#183.1 C?#184.1 C?#185.1 C?#186.1 C?#190.1 C?#194.1 C?#195.1 C?#196.1 C?#197.1 C?#198.1 C?#199.1 C?#200.1 C?#201.1 C?#202.1 C?#203.1 C?#204.1 C?#205.1 C?#206.1 C?#207.1 R?#89.1 U?#29.7(VDD) U?#29.8(VBAT) U?#29.13(VDD) U?#29.19(VDD) U?#29.32(VDD) U?#29.35(VREF+) U?#29.36(VDDA) U?#29.42(VDD) U?#29.56(VDD) U?#29.70(VDDLDO) U?#29.71(VDD) U?#29.79(VDD) U?#29.90(VDD50USB) U?#29.91(VDD33USB) U?#29.92(VDD) U?#29.105(VDDLDO) U?#29.106(VDD) U?#29.119(VDD) U?#29.129(VDD) U?#29.143(VDDLDO) U?#29.144(VDD)
GND: C?#186.2 C?#187.2 C?#188.2 C?#189.2 C?#190.2 C?#191.2 C?#192.2 C?#193.2 C?#207.2 C?#208.2 C?#209.2 C?#210.2 C?#211.2 C?#212.2 C?#213.2 C?#214.2 C?#215.2 C?#216.2 C?#217.2 C?#218.2 C?#219.2 C?#220.2 R?#88.1 U?#29.6(VSS) U?#29.12(VSS) U?#29.14(VSSSMPS) U?#29.16(VDDSMPS) U?#29.17(VFBSMPS) U?#29.18(VSS) U?#29.33(VSS) U?#29.34(VSSA) U?#29.41(VSS) U?#29.55(VSS) U?#29.69(VSS) U?#29.80(VSS) U?#29.89(VSS) U?#29.104(VSS) U?#29.118(VSS) U?#29.128(VSS) U?#29.141(VSS)
MCU_BOOT0: R?#88.2 U?#29.135(BOOT0) ; port MCU_BOOT_CTRL
MCU_PDR: R?#89.2 U?#29.142(PDR_ON)
MCU_~{RST}: U?#29.27(~{RST}) ; off-sheet MCU_WD_~{RESET}  [also labelled MCU_WD_~{RESET}]
MCU_VCAP1: C?#182.1 U?#29.68(VCAP)
MCU_VCAP2: C?#180.1 U?#29.103(VCAP)
MCU_VCAP3: C?#181.1 U?#29.140(VCAP)
NetC?#180_2: C?#180.2 C?#187.1
NetC?#181_2: C?#181.2 C?#188.1
NetC?#182_2: C?#182.2 C?#189.1
NetC?#183_2: C?#183.2 C?#191.1
NetC?#184_2: C?#184.2 C?#192.1
NetC?#185_2: C?#185.2 C?#193.1
NetC?#194_2: C?#194.2 C?#208.1
NetC?#195_2: C?#195.2 C?#209.1
NetC?#196_2: C?#196.2 C?#210.1
NetC?#197_2: C?#197.2 C?#211.1
NetC?#198_2: C?#198.2 C?#212.1
NetC?#199_2: C?#199.2 C?#213.1
NetC?#200_2: C?#200.2 C?#214.1
NetC?#201_2: C?#201.2 C?#215.1
NetC?#202_2: C?#202.2 C?#216.1
NetC?#203_2: C?#203.2 C?#217.1
NetC?#204_2: C?#204.2 C?#218.1
NetC?#205_2: C?#205.2 C?#219.1
NetC?#206_2: C?#206.2 C?#220.1

Not connected (* = marked no-connect by the designer): U?#29 15(VLXSMPS)*

### Notes on the sheet
- (near C?#193) VDDLDO
- (near C?#191) Between USB30 USB50
- (near C?#192) For VBat
- Project:
- Sub-system:
- Design by:
- Sheet title:
- Sheet
- A3
- of
- Checked by:
- Approved by:
- Revision:
- Document No:
- Size:
- Date:
- (in symbol TACL335M003RTA) +
- (in symbol TACR686M003RTA) +

### Library data of the parts
C?#180-C?#182 C?#185 C?#187-C?#189 C?#193 = Tu 0402 33nF 10V: 4.7 µF ±20% 6.3V Ceramic Capacitor X7T 0402 (1005 Metric): GRT155D70J475ME13J; Chung_Loai: Dán; Don_Vi: Con; So_Chan: 2; Ten_Linh_Kien: Tụ 0402 33nF X7R 10V GRM155R71A333KA01D; Ma_Hang: MH007853; Kieu_Chan: *
C?#183 C?#184 C?#191 C?#192 C?#194-C?#206 C?#208-C?#220 = Tu 0402 33nF 10V: as C?#128-C?#141 on sheet obc-v2_CM4-PinOut; Kieu_Chan: *
C?#186 C?#190 = TACL335M003RTA: 1 µF Molded Tantalum Capacitors 10 V 0603 (1608 Metric) 12Ohm @ 100kHz: TP8M105M010C; Package: None; Price: None; Value: *; MP: TACL335M003RTA; Availability: Unavailable
C?#207 = TACR686M003RTA: as C?#163 on sheet obc-v2_CM4-POWER; Availability: Unavailable; SnapEDA_Link: https://www.snapeda.com/parts/TACR686M003RTA/AVX/view-part/1745975/?ref=snap; MP: TACR686M003RTA; Value: *; Price: None; Package: 0805 AVX
R?#88 R?#89 = Tro 0603 1% 10k: as R?#62 on sheet obc-v2_CM4-PinOut; Kieu_Chan: *
U?#29 = CMP-12105-000054-1: HIGH-PERFORMANCE AND DSP WITH DP; Manufacturer Part Number: STM32H745ZIT6; Manufacturer: STMicroelectronics; Number Of Timers/Counters: 20; Min Supply Voltage: 1.62V; Frequency: 480MHz; Number Of I2C Channels: 4; Memory Type: FLASH; Number Of I/Os: 97; Number Of Pwm Channels: 42; Number Of Usb Channels: 2; Ram Size: 1MBytes; Memory Size: 2MBytes; Data Bus Width: 32bits; Number Of Adc Channels: 23; Number Of Ethernet Channels: 1; Number Of Uart Channels: 9; Interface: I2C,SPI,UART,USART,CAN,USB,LIN,IrDA,Ethernet,I2S,Other; Number Of A/D Converters: 3; Max Junction Temp: +125°C; Max Supply Voltage: 3.6V; Core Architecture: ARM Cortex-M4, Cortex-M7; Number Of Spi Channels: 6; Standoff Height: 0.05mm; Ambient Temperature Range Low: -40°C; Lead Free: Yes; Automotive: No; Height: 1.6mm; Device Class L1: Integrated Circuits (ICs); Ambient Temperature Range High: +85°C; RoHS: TRUE; Temperature Range High: +125°C; Temperature: -40°C to +125°C; Category: IC; Device Class L2: Embedded Processors and Controllers; Number Of Cores: 2; Temperature Range Low: -40°C; Octopart: https://octopart.com/stm32h745zit6-stmicroelectronics-100293939; Digikey Description: HIGH-PERFORMANCE AND DSP WITH DP; Package: LQFP144-1A; Device Class L3: Microcontrollers; ComponentLink2URL: https://www.st.com/resource/en/datasheet/stm32h745zi.pdf; ComponentLink2Description: Datasheet